# EasyEDA Pro project NeuralAccelerator_EasyEDA.epro, board PCB1
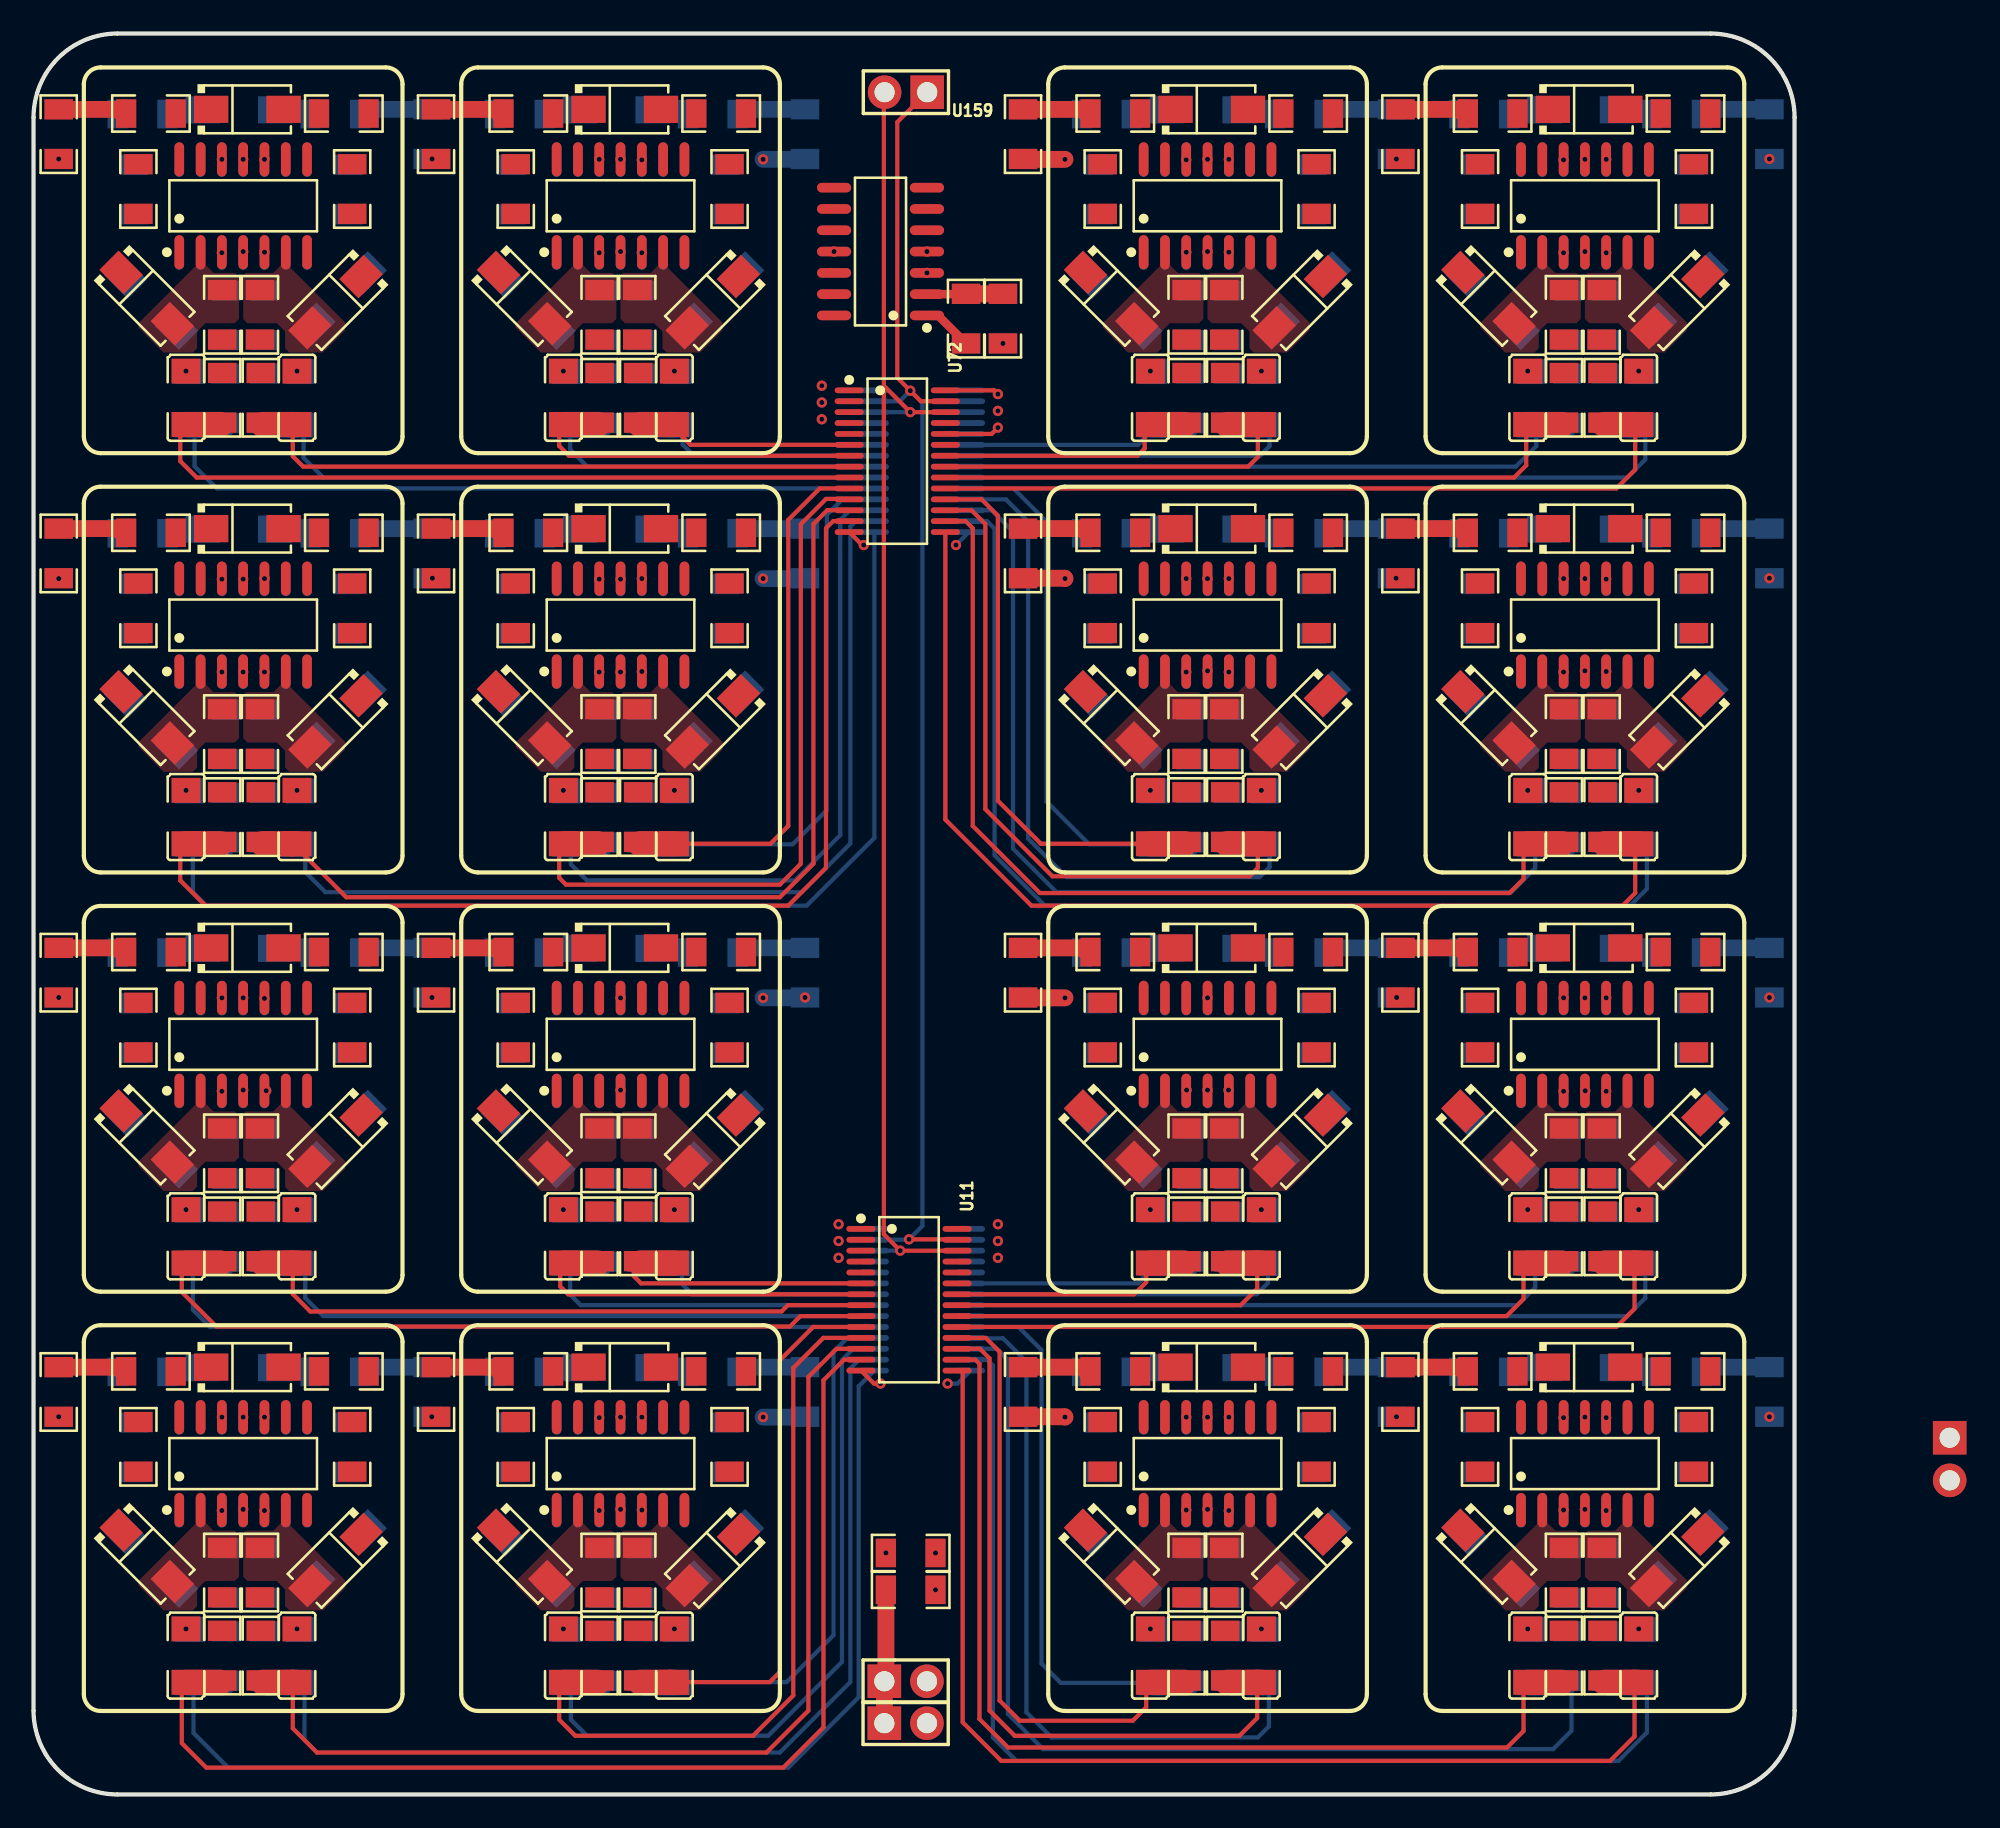
[diagram p6: board, top side]
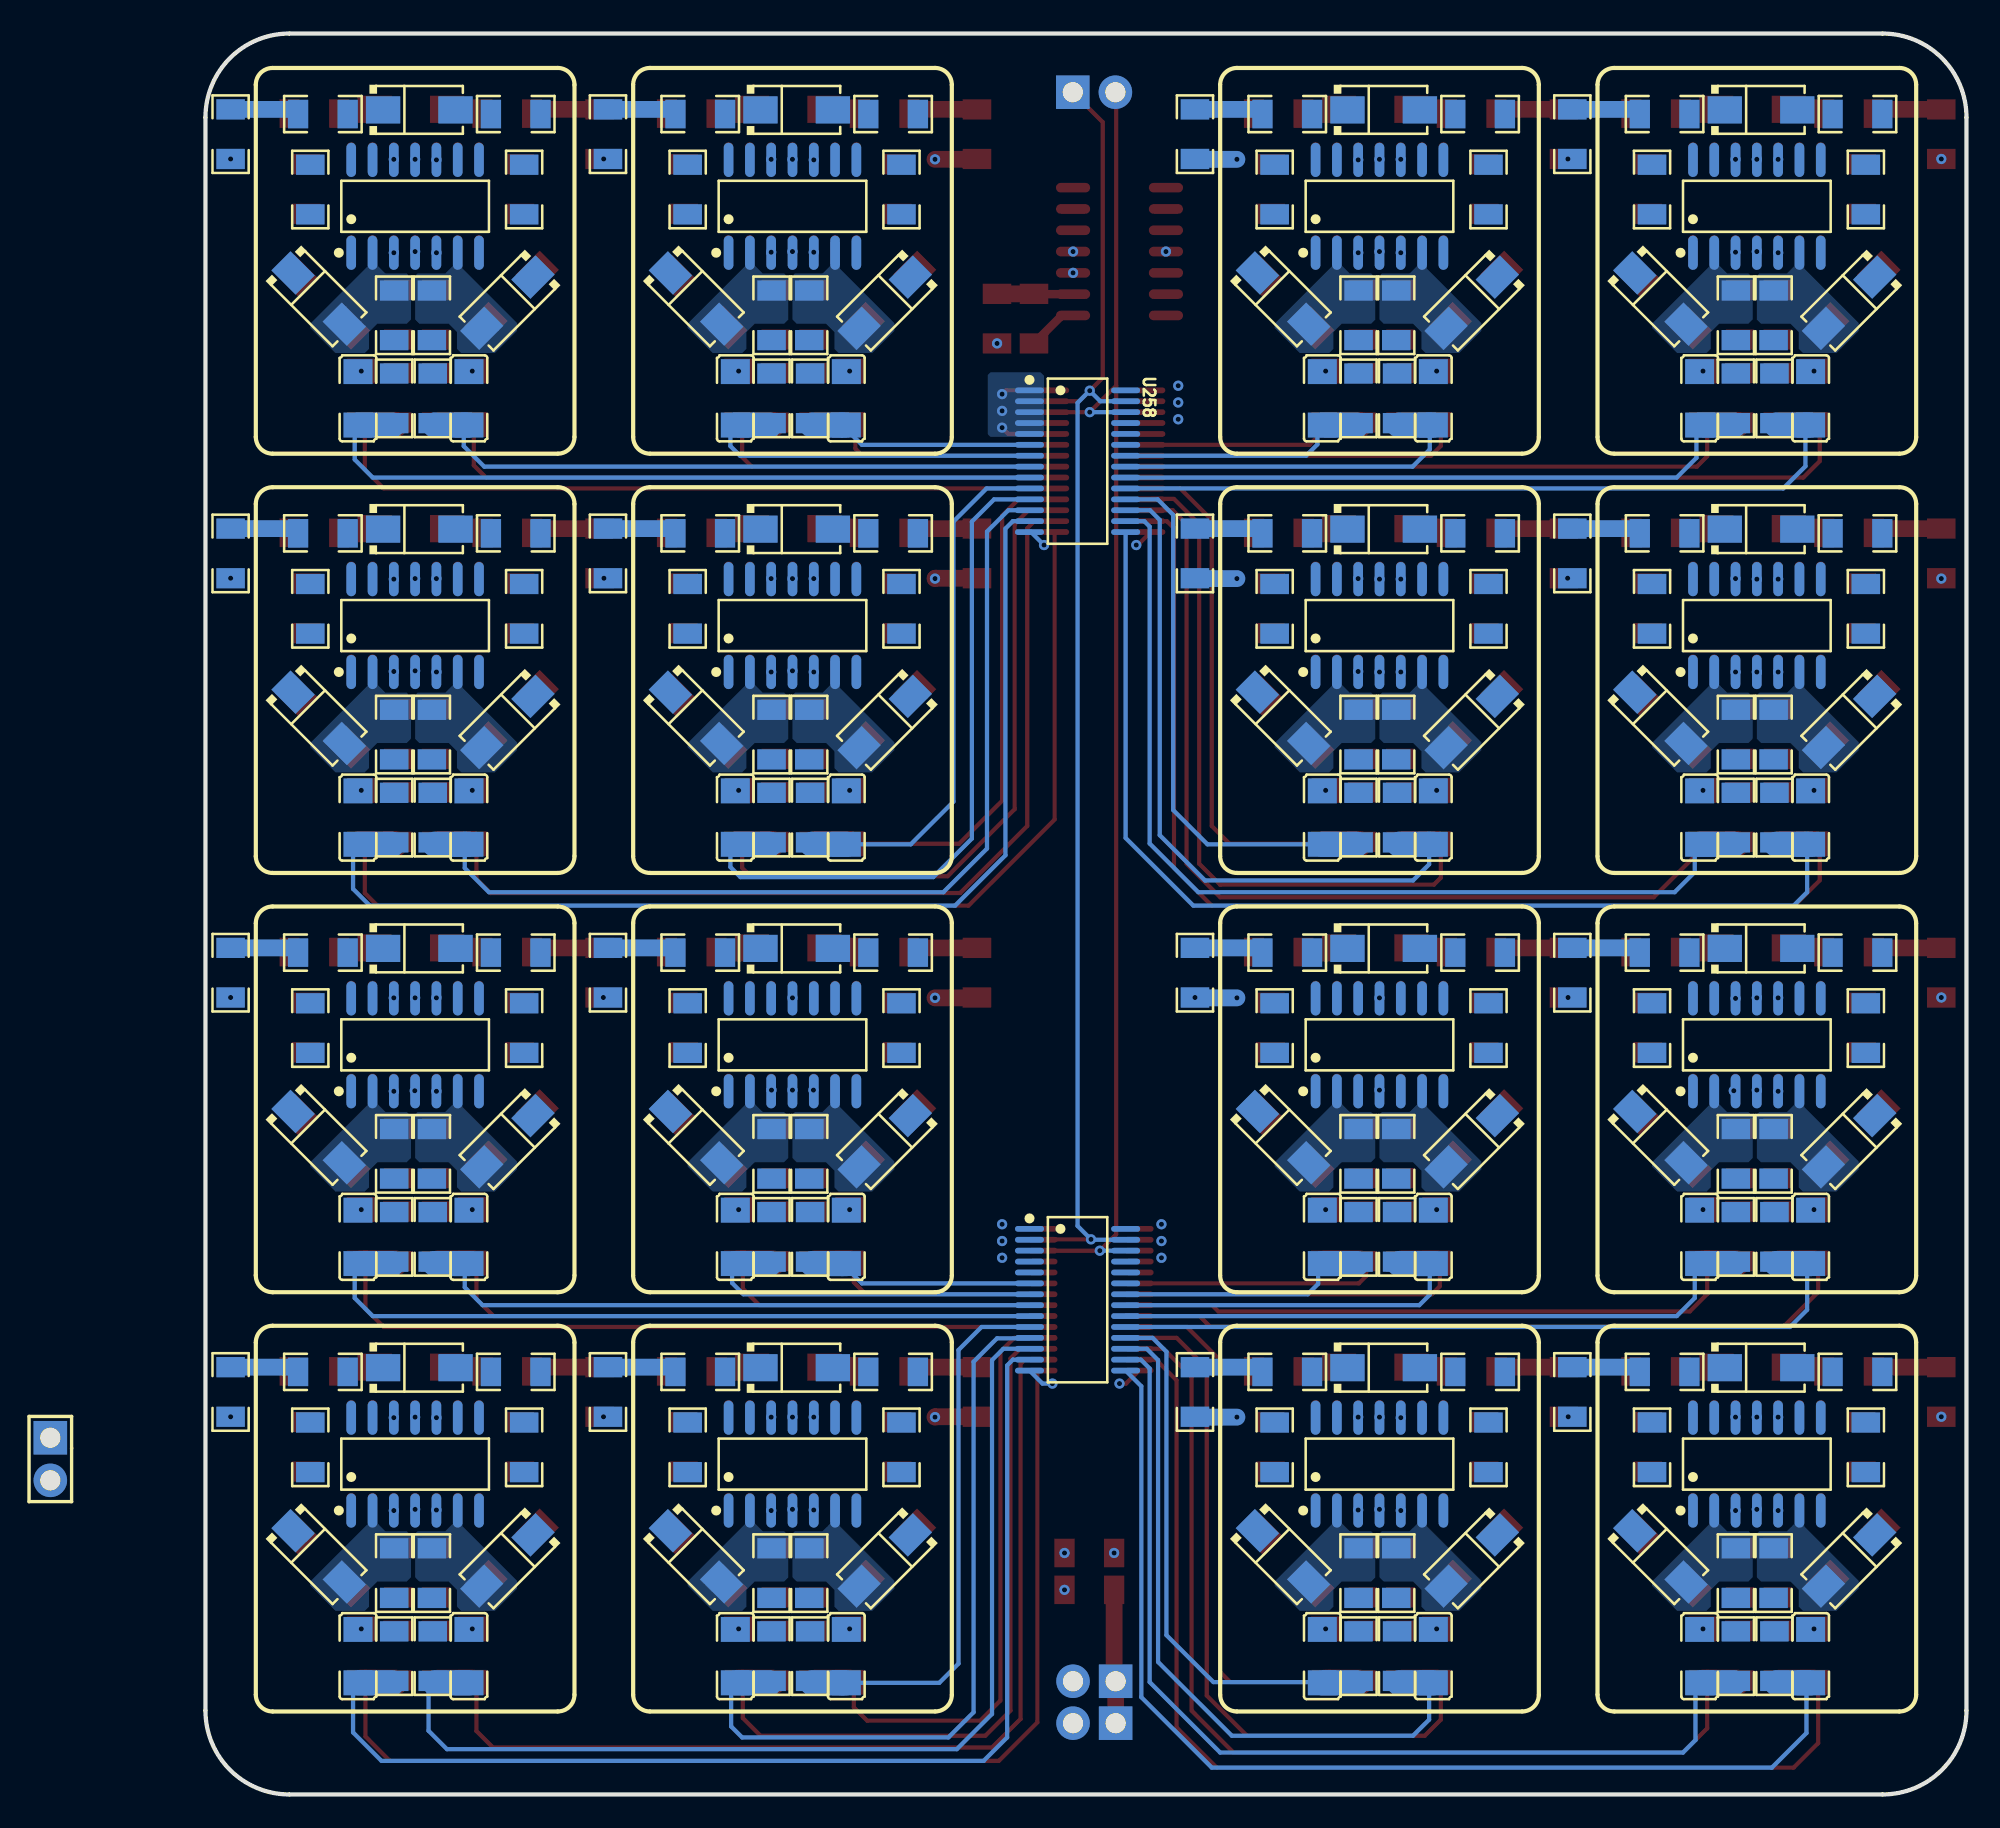
[diagram p7: board, bottom side, seen from below]

Outline 105 x 105 mm; copper layers: Top Layer, Inner1, Inner2, Inner3, Inner4, Bottom Layer. Coordinates in mm from the lower left corner of the outline.
Outline path: 0,100 0,5 arc(1.46,1.46) 5,0 100,0 arc(103.54,1.46) 105,5 105,100 arc(103.54,103.54) 100,105 5,105 arc(1.46,103.54) 0,100
Stack: Top Layer 0.035mm 外层铜厚1oz / Dielectric1 0.0994mm 3313 RC57% 4.2mil / Inner1 0.0152mm 内层铜厚 / Dielectric2 0.55mm 0.55mm H/H不含铜 / Inner2 0.0152mm 内层铜厚 / Dielectric3 0.1088mm 2116 RC54% 4.9mil / Inner3 0.0152mm 内层铜厚 / Dielectric4 0.55mm 0.55mm H/H不含铜 / Inner4 0.0152mm 内层铜厚 / Dielectric5 0.0994mm 3313 RC57% 4.2mil / Bottom Layer 0.035mm 外层铜厚1oz

## Design rules (mm)
template: Custom Config
spacing copperThickness1oz (default): track to track 0.102, other pairs 0.152 to 0.3
spacing copperThickness2oz: track to track 0.203, other pairs 0.152 to 0.3
track width copperThickness1oz (default): min 0.127, default 0.254, max 10
track width copperThickness2oz: min 0.203, default 0.254, max 2.54
differential pair differentialPair (default): width min 0.127, default 0.254, max 2.54; gap min 0.152, default 0.152
via viaSize (default): diameter min 0.5, default 0.61, max 10; hole min 0.3, default 0.305, max 6.3

## Placement (name value [footprint] x y rotation side)
R1  50K±0.1%  [R1206]  52.3 14.4 0 top
R2  50K±0.1%  [R1206]  52.3 12.2 180 top
R3  6.2Ω  [R1206]  11.25 8.28 90 top
R4  6.2Ω  [R1206]  13.55 8.28 90 top
R5  50K±0.1%  [R1206]  33.75 13.23 270 top
R6  50K±0.1%  [R1206]  36 13.23 270 top
R7  50K±0.1%  [R1206]  11.25 13.23 270 top
R8  50K±0.1%  [R1206]  13.5 13.23 270 top
R9  50K±0.1%  [R1206]  6.25 20.73 270 top
R10  50K±0.1%  [R1206]  19 20.73 270 top
R11  50K±0.1%  [R1206]  18.5 25.23 0 top
R12  50K±0.1%  [R1206]  7 25.23 0 top
R13  50K±0.1%  [R1206]  28.75 20.73 270 top
R14  50K±0.1%  [R1206]  41.5 20.73 270 top
R15  50K±0.1%  [R1206]  41 25.23 0 top
R16  50K±0.1%  [R1206]  29.5 25.23 0 top
R17  6.2Ω  [R1206]  33.75 8.28 90 top
R18  6.2Ω  [R1206]  36.05 8.28 90 top
R172  50K±0.1%  [R1206]  1.5 24 90 top
R175  50K±0.1%  [R1206]  24 24 90 top
R192  50K±0.1%  [R1206]  59 24 90 top
R193  50K±0.1%  [R1206]  81.5 24 90 top
R226  50K±0.1%  [R1206]  1.5 49 90 top
R227  50K±0.1%  [R1206]  24 49 90 top
R228  50K±0.1%  [R1206]  59 49 90 top
R229  50K±0.1%  [R1206]  81.5 49 90 top
R294  50K±0.1%  [R1206]  1.5 74 90 top
R295  50K±0.1%  [R1206]  24 74 90 top
R296  50K±0.1%  [R1206]  59 74 90 top
R297  50K±0.1%  [R1206]  81.5 74 90 top
R298  50K±0.1%  [R1206]  1.5 99 90 top
R299  50K±0.1%  [R1206]  24 99 90 top
R300  50K±0.1%  [R1206]  59 99 90 top
R301  50K±0.1%  [R1206]  81.5 99 90 top
R302  50K±0.1%  [R1206]  68.75 13.23 270 top
R303  50K±0.1%  [R1206]  91.25 13.23 270 top
R304  50K±0.1%  [R1206]  71 13.23 270 top
R305  50K±0.1%  [R1206]  93.5 13.23 270 top
R306  50K±0.1%  [R1206]  63.75 20.73 270 top
R307  50K±0.1%  [R1206]  86.25 20.73 270 top
R308  50K±0.1%  [R1206]  76.5 20.73 270 top
R309  50K±0.1%  [R1206]  99 20.73 270 top
R310  50K±0.1%  [R1206]  76 25.23 0 top
R311  50K±0.1%  [R1206]  98.5 25.23 0 top
R312  50K±0.1%  [R1206]  64.5 25.23 0 top
R313  50K±0.1%  [R1206]  87 25.23 0 top
R314  6.2Ω  [R1206]  68.75 8.28 90 top
R315  6.2Ω  [R1206]  91.25 8.28 90 top
R316  6.2Ω  [R1206]  71.05 8.28 90 top
R317  6.2Ω  [R1206]  93.55 8.28 90 top
R318  50K±0.1%  [R1206]  11.25 38.23 270 top
R319  50K±0.1%  [R1206]  33.75 38.23 270 top
R320  50K±0.1%  [R1206]  68.75 38.23 270 top
R321  50K±0.1%  [R1206]  91.25 38.23 270 top
R322  50K±0.1%  [R1206]  13.5 38.23 270 top
R323  50K±0.1%  [R1206]  36 38.23 270 top
R324  50K±0.1%  [R1206]  71 38.23 270 top
R325  50K±0.1%  [R1206]  93.5 38.23 270 top
R326  50K±0.1%  [R1206]  6.25 45.73 270 top
R327  50K±0.1%  [R1206]  28.75 45.73 270 top
R328  50K±0.1%  [R1206]  63.75 45.73 270 top
R329  50K±0.1%  [R1206]  86.25 45.73 270 top
R330  50K±0.1%  [R1206]  19 45.73 270 top
R331  50K±0.1%  [R1206]  41.5 45.73 270 top
R332  50K±0.1%  [R1206]  76.5 45.73 270 top
R333  50K±0.1%  [R1206]  99 45.73 270 top
R334  50K±0.1%  [R1206]  18.5 50.23 0 top
R335  50K±0.1%  [R1206]  41 50.23 0 top
R336  50K±0.1%  [R1206]  76 50.23 0 top
R337  50K±0.1%  [R1206]  98.5 50.23 0 top
R338  50K±0.1%  [R1206]  7 50.23 0 top
R339  50K±0.1%  [R1206]  29.5 50.23 0 top
R340  50K±0.1%  [R1206]  64.5 50.23 0 top
R341  50K±0.1%  [R1206]  87 50.23 0 top
R342  6.2Ω  [R1206]  11.25 33.28 90 top
R343  6.2Ω  [R1206]  33.75 33.28 90 top
R344  6.2Ω  [R1206]  68.75 33.28 90 top
R345  6.2Ω  [R1206]  91.25 33.28 90 top
R346  6.2Ω  [R1206]  13.55 33.28 90 top
R347  6.2Ω  [R1206]  36.05 33.28 90 top
R348  6.2Ω  [R1206]  71.05 33.28 90 top
R349  6.2Ω  [R1206]  93.55 33.28 90 top
R350  50K±0.1%  [R1206]  11.25 88.23 270 top
R351  50K±0.1%  [R1206]  33.75 88.23 270 top
R352  50K±0.1%  [R1206]  68.75 88.23 270 top
R353  50K±0.1%  [R1206]  91.25 88.23 270 top
R354  50K±0.1%  [R1206]  91.25 63.23 270 top
R355  50K±0.1%  [R1206]  68.75 63.23 270 top
R356  50K±0.1%  [R1206]  33.75 63.23 270 top
R357  50K±0.1%  [R1206]  11.25 63.23 270 top
R358  50K±0.1%  [R1206]  13.5 88.23 270 top
R359  50K±0.1%  [R1206]  36 88.23 270 top
R360  50K±0.1%  [R1206]  71 88.23 270 top
R361  50K±0.1%  [R1206]  93.5 88.23 270 top
R362  50K±0.1%  [R1206]  93.5 63.23 270 top
R363  50K±0.1%  [R1206]  71 63.23 270 top
R364  50K±0.1%  [R1206]  36 63.23 270 top
R365  50K±0.1%  [R1206]  13.5 63.23 270 top
R366  50K±0.1%  [R1206]  6.25 95.73 270 top
R367  50K±0.1%  [R1206]  28.75 95.73 270 top
R368  50K±0.1%  [R1206]  63.75 95.73 270 top
R369  50K±0.1%  [R1206]  86.25 95.73 270 top
R370  50K±0.1%  [R1206]  86.25 70.73 270 top
R371  50K±0.1%  [R1206]  63.75 70.73 270 top
R372  50K±0.1%  [R1206]  28.75 70.73 270 top
R373  50K±0.1%  [R1206]  6.25 70.73 270 top
R374  50K±0.1%  [R1206]  19 95.73 270 top
R375  50K±0.1%  [R1206]  41.5 95.73 270 top
R376  50K±0.1%  [R1206]  76.5 95.73 270 top
R377  50K±0.1%  [R1206]  99 95.73 270 top
R378  50K±0.1%  [R1206]  99 70.73 270 top
R379  50K±0.1%  [R1206]  76.5 70.73 270 top
R380  50K±0.1%  [R1206]  41.5 70.73 270 top
R381  50K±0.1%  [R1206]  19 70.73 270 top
R382  50K±0.1%  [R1206]  18.5 100.23 0 top
R383  50K±0.1%  [R1206]  41 100.23 0 top
R384  50K±0.1%  [R1206]  76 100.23 0 top
R385  50K±0.1%  [R1206]  98.5 100.23 0 top
R386  50K±0.1%  [R1206]  98.5 75.23 0 top
R387  50K±0.1%  [R1206]  76 75.23 0 top
R388  50K±0.1%  [R1206]  41 75.23 0 top
R389  50K±0.1%  [R1206]  18.5 75.23 0 top
R390  50K±0.1%  [R1206]  7 100.23 0 top
R391  50K±0.1%  [R1206]  29.5 100.23 0 top
R392  50K±0.1%  [R1206]  64.5 100.23 0 top
R393  50K±0.1%  [R1206]  87 100.23 0 top
R394  50K±0.1%  [R1206]  87 75.23 0 top
R395  50K±0.1%  [R1206]  64.5 75.23 0 top
R396  50K±0.1%  [R1206]  29.5 75.23 0 top
R397  50K±0.1%  [R1206]  7 75.23 0 top
R398  6.2Ω  [R1206]  11.25 83.28 90 top
R399  6.2Ω  [R1206]  33.75 83.28 90 top
R400  6.2Ω  [R1206]  68.75 83.28 90 top
R401  6.2Ω  [R1206]  91.25 83.28 90 top
R402  6.2Ω  [R1206]  91.25 58.28 90 top
R403  6.2Ω  [R1206]  68.75 58.28 90 top
R404  6.2Ω  [R1206]  33.75 58.28 90 top
R405  6.2Ω  [R1206]  11.25 58.28 90 top
R406  6.2Ω  [R1206]  13.55 83.28 90 top
R407  6.2Ω  [R1206]  36.05 83.28 90 top
R408  6.2Ω  [R1206]  71.05 83.28 90 top
R409  6.2Ω  [R1206]  93.55 83.28 90 top
R410  6.2Ω  [R1206]  93.55 58.28 90 top
R411  6.2Ω  [R1206]  71.05 58.28 90 top
R412  6.2Ω  [R1206]  36.05 58.28 90 top
R413  6.2Ω  [R1206]  13.55 58.28 90 top
R414  50K±0.1%  [R1206]  93.75 13.2 270 bottom
R415  50K±0.1%  [R1206]  71.25 13.2 270 bottom
R416  50K±0.1%  [R1206]  36.25 13.2 270 bottom
R417  50K±0.1%  [R1206]  13.75 13.2 270 bottom
R418  50K±0.1%  [R1206]  93.75 38.2 270 bottom
R419  50K±0.1%  [R1206]  71.25 38.2 270 bottom
R420  50K±0.1%  [R1206]  36.25 38.2 270 bottom
R421  50K±0.1%  [R1206]  13.75 38.2 270 bottom
R422  50K±0.1%  [R1206]  93.75 63.2 270 bottom
R423  50K±0.1%  [R1206]  71.25 63.2 270 bottom
R424  50K±0.1%  [R1206]  36.25 63.2 270 bottom
R425  50K±0.1%  [R1206]  13.75 63.2 270 bottom
R426  50K±0.1%  [R1206]  93.75 88.2 270 bottom
R427  50K±0.1%  [R1206]  71.25 88.2 270 bottom
R428  50K±0.1%  [R1206]  36.25 88.2 270 bottom
R429  50K±0.1%  [R1206]  13.75 88.2 270 bottom
R430  50K±0.1%  [R1206]  91.5 13.2 270 bottom
R431  50K±0.1%  [R1206]  69 13.2 270 bottom
R432  50K±0.1%  [R1206]  34 13.2 270 bottom
R433  50K±0.1%  [R1206]  11.5 13.2 270 bottom
R434  50K±0.1%  [R1206]  91.5 38.2 270 bottom
R435  50K±0.1%  [R1206]  69 38.2 270 bottom
R436  50K±0.1%  [R1206]  34 38.2 270 bottom
R437  50K±0.1%  [R1206]  11.5 38.2 270 bottom
R438  50K±0.1%  [R1206]  91.5 63.2 270 bottom
R439  50K±0.1%  [R1206]  69 63.2 270 bottom
R440  50K±0.1%  [R1206]  34 63.2 270 bottom
R441  50K±0.1%  [R1206]  11.5 63.2 270 bottom
R442  50K±0.1%  [R1206]  91.5 88.2 270 bottom
R443  50K±0.1%  [R1206]  69 88.2 270 bottom
R444  50K±0.1%  [R1206]  34 88.2 270 bottom
R445  50K±0.1%  [R1206]  11.5 88.2 270 bottom
R446  50K±0.1%  [R1206]  98.75 20.7 270 bottom
R447  50K±0.1%  [R1206]  76.25 20.7 270 bottom
R448  50K±0.1%  [R1206]  41.25 20.7 270 bottom
R449  50K±0.1%  [R1206]  18.75 20.7 270 bottom
R450  50K±0.1%  [R1206]  98.75 45.7 270 bottom
R451  50K±0.1%  [R1206]  76.25 45.7 270 bottom
R452  50K±0.1%  [R1206]  41.25 45.7 270 bottom
R453  50K±0.1%  [R1206]  18.75 45.7 270 bottom
R454  50K±0.1%  [R1206]  98.75 70.7 270 bottom
R455  50K±0.1%  [R1206]  76.25 70.7 270 bottom
R456  50K±0.1%  [R1206]  41.25 70.7 270 bottom
R457  50K±0.1%  [R1206]  18.75 70.7 270 bottom
R458  50K±0.1%  [R1206]  98.75 95.7 270 bottom
R459  50K±0.1%  [R1206]  76.25 95.7 270 bottom
R460  50K±0.1%  [R1206]  41.25 95.7 270 bottom
R461  50K±0.1%  [R1206]  18.75 95.7 270 bottom
R462  50K±0.1%  [R1206]  86 20.7 270 bottom
R463  50K±0.1%  [R1206]  63.5 20.7 270 bottom
R464  50K±0.1%  [R1206]  28.5 20.7 270 bottom
R465  50K±0.1%  [R1206]  6 20.7 270 bottom
R466  50K±0.1%  [R1206]  86 45.7 270 bottom
R467  50K±0.1%  [R1206]  63.5 45.7 270 bottom
R468  50K±0.1%  [R1206]  28.5 45.7 270 bottom
R469  50K±0.1%  [R1206]  6 45.7 270 bottom
R470  50K±0.1%  [R1206]  86 70.7 270 bottom
R471  50K±0.1%  [R1206]  63.5 70.7 270 bottom
R472  50K±0.1%  [R1206]  28.5 70.7 270 bottom
R473  50K±0.1%  [R1206]  6 70.7 270 bottom
R474  50K±0.1%  [R1206]  86 95.7 270 bottom
R475  50K±0.1%  [R1206]  63.5 95.7 270 bottom
R476  50K±0.1%  [R1206]  28.5 95.7 270 bottom
R477  50K±0.1%  [R1206]  6 95.7 270 bottom
R478  50K±0.1%  [R1206]  86.5 25.2 180 bottom
R479  50K±0.1%  [R1206]  64 25.2 180 bottom
R480  50K±0.1%  [R1206]  29 25.2 180 bottom
R481  50K±0.1%  [R1206]  6.5 25.2 180 bottom
R482  50K±0.1%  [R1206]  86.5 50.2 180 bottom
R483  50K±0.1%  [R1206]  64 50.2 180 bottom
R484  50K±0.1%  [R1206]  29 50.2 180 bottom
R485  50K±0.1%  [R1206]  6.5 50.2 180 bottom
R486  50K±0.1%  [R1206]  86.5 75.2 180 bottom
R487  50K±0.1%  [R1206]  64 75.2 180 bottom
R488  50K±0.1%  [R1206]  29 75.2 180 bottom
R489  50K±0.1%  [R1206]  6.5 75.2 180 bottom
R490  50K±0.1%  [R1206]  86.5 100.2 180 bottom
R491  50K±0.1%  [R1206]  64 100.2 180 bottom
R492  50K±0.1%  [R1206]  29 100.2 180 bottom
R493  50K±0.1%  [R1206]  6.5 100.2 180 bottom
R494  50K±0.1%  [R1206]  98 25.2 180 bottom
R495  50K±0.1%  [R1206]  75.5 25.2 180 bottom
R496  50K±0.1%  [R1206]  40.5 25.2 180 bottom
R497  50K±0.1%  [R1206]  18 25.2 180 bottom
R498  50K±0.1%  [R1206]  98 50.2 180 bottom
R499  50K±0.1%  [R1206]  75.5 50.2 180 bottom
R500  50K±0.1%  [R1206]  40.5 50.2 180 bottom
R501  50K±0.1%  [R1206]  18 50.2 180 bottom
R502  50K±0.1%  [R1206]  98 75.2 180 bottom
R503  50K±0.1%  [R1206]  75.5 75.2 180 bottom
R504  50K±0.1%  [R1206]  40.5 75.2 180 bottom
R505  50K±0.1%  [R1206]  18 75.2 180 bottom
R506  50K±0.1%  [R1206]  98 100.2 180 bottom
R507  50K±0.1%  [R1206]  75.5 100.2 180 bottom
R508  50K±0.1%  [R1206]  40.5 100.2 180 bottom
R509  50K±0.1%  [R1206]  18 100.2 180 bottom
R510  6.2Ω  [R1206]  93.75 8.25 90 bottom
R511  6.2Ω  [R1206]  71.25 8.25 90 bottom
R512  6.2Ω  [R1206]  36.25 8.25 90 bottom
R513  6.2Ω  [R1206]  13.75 8.25 90 bottom
R514  6.2Ω  [R1206]  93.75 33.25 90 bottom
R515  6.2Ω  [R1206]  71.25 33.25 90 bottom
R516  6.2Ω  [R1206]  36.25 33.25 90 bottom
R517  6.2Ω  [R1206]  13.75 33.25 90 bottom
R518  6.2Ω  [R1206]  93.75 58.25 90 bottom
R519  6.2Ω  [R1206]  71.25 58.25 90 bottom
R520  6.2Ω  [R1206]  36.25 58.25 90 bottom
R521  6.2Ω  [R1206]  13.75 58.25 90 bottom
R522  6.2Ω  [R1206]  93.75 83.25 90 bottom
R523  6.2Ω  [R1206]  71.25 83.25 90 bottom
R524  6.2Ω  [R1206]  36.25 83.25 90 bottom
R525  6.2Ω  [R1206]  13.75 83.25 90 bottom
R526  6.2Ω  [R1206]  91.45 8.25 90 bottom
R527  6.2Ω  [R1206]  68.95 8.25 90 bottom
R528  6.2Ω  [R1206]  33.95 8.25 90 bottom
R529  6.2Ω  [R1206]  11.45 8.25 90 bottom
R530  6.2Ω  [R1206]  91.45 33.25 90 bottom
R531  6.2Ω  [R1206]  68.95 33.25 90 bottom
R532  6.2Ω  [R1206]  33.95 33.25 90 bottom
R533  6.2Ω  [R1206]  11.45 33.25 90 bottom
R534  6.2Ω  [R1206]  91.45 58.25 90 bottom
R535  6.2Ω  [R1206]  68.95 58.25 90 bottom
R536  6.2Ω  [R1206]  33.95 58.25 90 bottom
R537  6.2Ω  [R1206]  11.45 58.25 90 bottom
R538  6.2Ω  [R1206]  91.45 83.25 90 bottom
R539  6.2Ω  [R1206]  68.95 83.25 90 bottom
R540  6.2Ω  [R1206]  33.95 83.25 90 bottom
R541  6.2Ω  [R1206]  11.45 83.25 90 bottom
R542  50K±0.1%  [R1206]  103.5 24 90 bottom
R543  50K±0.1%  [R1206]  81 24 90 bottom
R544  50K±0.1%  [R1206]  46 24 90 bottom
R545  50K±0.1%  [R1206]  23.5 24 90 bottom
R546  50K±0.1%  [R1206]  103.5 49 90 bottom
R547  50K±0.1%  [R1206]  81 49 90 bottom
R548  50K±0.1%  [R1206]  46 49 90 bottom
R549  50K±0.1%  [R1206]  23.5 49 90 bottom
R550  50K±0.1%  [R1206]  103.5 74 90 bottom
R551  50K±0.1%  [R1206]  81 74 90 bottom
R552  50K±0.1%  [R1206]  46 74 90 bottom
R553  50K±0.1%  [R1206]  23.5 74 90 bottom
R554  50K±0.1%  [R1206]  103.5 99 90 bottom
R555  50K±0.1%  [R1206]  81 99 90 bottom
R556  50K±0.1%  [R1206]  46 99 90 bottom
R557  50K±0.1%  [R1206]  23.5 99 90 bottom
Ra  50K±0.1%  [R1206]  55.6 88 270 top
Rb  50K±0.1%  [R1206]  57.8 88 90 top
U1  12pF  [C1206]  9.09 8.28 270 top
U2  12pF  [C1206]  15.71 8.28 270 top
U3  1N4007 M7  [SMA_L4.2-W2.7-LS5.3-RD]  29.25 14.23 315 top
U4  1N4007 M7  [SMA_L4.2-W2.7-LS5.3-RD]  40.5 13.98 225 top
U5  1N4007 M7  [SMA_L4.2-W2.7-LS5.3-RD]  35.25 25.48 0 top
U6  TL084CDR  [SOIC-14_L8.7-W3.9-P1.27-LS6.0-BL]  12.5 19.73 0 top
U7  1N4007 M7  [SMA_L4.2-W2.7-LS5.3-RD]  6.75 14.23 315 top
U8  1N4007 M7  [SMA_L4.2-W2.7-LS5.3-RD]  18 13.98 225 top
U9  1N4007 M7  [SMA_L4.2-W2.7-LS5.3-RD]  12.75 25.48 0 top
U10  TL084CDRG4  [SOIC-14_L8.7-W3.9-P1.27-LS6.0-BL]  50.5 92 90 top
U11  PCA9685PW,112  [TSSOP-28_L9.7-W4.4-P0.65-LS6.4-BL]  52.2 29.5 270 top
U12  12pF  [C1206]  31.59 8.28 270 top
U13  12pF  [C1206]  38.21 8.28 270 top
U14  TL084CDR  [SOIC-14_L8.7-W3.9-P1.27-LS6.0-BL]  35 19.73 0 top
U72  PCA9685PW,112  [TSSOP-28_L9.7-W4.4-P0.65-LS6.4-BL]  51.5 79.5 270 top
U73  1N4007 M7  [SMA_L4.2-W2.7-LS5.3-RD]  64.25 14.23 315 top
U74  1N4007 M7  [SMA_L4.2-W2.7-LS5.3-RD]  86.75 14.23 315 top
U75  1N4007 M7  [SMA_L4.2-W2.7-LS5.3-RD]  75.5 13.98 225 top
U76  1N4007 M7  [SMA_L4.2-W2.7-LS5.3-RD]  98 13.98 225 top
U77  1N4007 M7  [SMA_L4.2-W2.7-LS5.3-RD]  70.25 25.48 0 top
U78  1N4007 M7  [SMA_L4.2-W2.7-LS5.3-RD]  92.75 25.48 0 top
U79  12pF  [C1206]  66.59 8.28 270 top
U80  12pF  [C1206]  89.09 8.28 270 top
U81  12pF  [C1206]  73.21 8.28 270 top
U82  12pF  [C1206]  95.71 8.28 270 top
U83  TL084CDR  [SOIC-14_L8.7-W3.9-P1.27-LS6.0-BL]  70 19.73 0 top
U84  TL084CDR  [SOIC-14_L8.7-W3.9-P1.27-LS6.0-BL]  92.5 19.73 0 top
U85  1N4007 M7  [SMA_L4.2-W2.7-LS5.3-RD]  6.75 39.23 315 top
U86  1N4007 M7  [SMA_L4.2-W2.7-LS5.3-RD]  29.25 39.23 315 top
U87  1N4007 M7  [SMA_L4.2-W2.7-LS5.3-RD]  64.25 39.23 315 top
U88  1N4007 M7  [SMA_L4.2-W2.7-LS5.3-RD]  86.75 39.23 315 top
U89  1N4007 M7  [SMA_L4.2-W2.7-LS5.3-RD]  18 38.98 225 top
U90  1N4007 M7  [SMA_L4.2-W2.7-LS5.3-RD]  40.5 38.98 225 top
U91  1N4007 M7  [SMA_L4.2-W2.7-LS5.3-RD]  75.5 38.98 225 top
U92  1N4007 M7  [SMA_L4.2-W2.7-LS5.3-RD]  98 38.98 225 top
U93  1N4007 M7  [SMA_L4.2-W2.7-LS5.3-RD]  12.75 50.48 0 top
U94  1N4007 M7  [SMA_L4.2-W2.7-LS5.3-RD]  35.25 50.48 0 top
U95  1N4007 M7  [SMA_L4.2-W2.7-LS5.3-RD]  70.25 50.48 0 top
U96  1N4007 M7  [SMA_L4.2-W2.7-LS5.3-RD]  92.75 50.48 0 top
U97  12pF  [C1206]  9.09 33.28 270 top
U98  12pF  [C1206]  31.59 33.28 270 top
U99  12pF  [C1206]  66.59 33.28 270 top
U100  12pF  [C1206]  89.09 33.28 270 top
U101  12pF  [C1206]  15.71 33.28 270 top
U102  12pF  [C1206]  38.21 33.28 270 top
U103  12pF  [C1206]  73.21 33.28 270 top
U104  12pF  [C1206]  95.71 33.28 270 top
U105  TL084CDR  [SOIC-14_L8.7-W3.9-P1.27-LS6.0-BL]  12.5 44.73 0 top
U106  TL084CDR  [SOIC-14_L8.7-W3.9-P1.27-LS6.0-BL]  35 44.73 0 top
U107  TL084CDR  [SOIC-14_L8.7-W3.9-P1.27-LS6.0-BL]  70 44.73 0 top
U108  TL084CDR  [SOIC-14_L8.7-W3.9-P1.27-LS6.0-BL]  92.5 44.73 0 top
U109  1N4007 M7  [SMA_L4.2-W2.7-LS5.3-RD]  6.75 89.23 315 top
U110  1N4007 M7  [SMA_L4.2-W2.7-LS5.3-RD]  29.25 89.23 315 top
U111  1N4007 M7  [SMA_L4.2-W2.7-LS5.3-RD]  64.25 89.23 315 top
U112  1N4007 M7  [SMA_L4.2-W2.7-LS5.3-RD]  86.75 89.23 315 top
U113  1N4007 M7  [SMA_L4.2-W2.7-LS5.3-RD]  86.75 64.23 315 top
U114  1N4007 M7  [SMA_L4.2-W2.7-LS5.3-RD]  64.25 64.23 315 top
U115  1N4007 M7  [SMA_L4.2-W2.7-LS5.3-RD]  29.25 64.23 315 top
U116  1N4007 M7  [SMA_L4.2-W2.7-LS5.3-RD]  6.75 64.23 315 top
U117  1N4007 M7  [SMA_L4.2-W2.7-LS5.3-RD]  18 88.98 225 top
U118  1N4007 M7  [SMA_L4.2-W2.7-LS5.3-RD]  40.5 88.98 225 top
U119  1N4007 M7  [SMA_L4.2-W2.7-LS5.3-RD]  75.5 88.98 225 top
U120  1N4007 M7  [SMA_L4.2-W2.7-LS5.3-RD]  98 88.98 225 top
U121  1N4007 M7  [SMA_L4.2-W2.7-LS5.3-RD]  98 63.98 225 top
U122  1N4007 M7  [SMA_L4.2-W2.7-LS5.3-RD]  75.5 63.98 225 top
U123  1N4007 M7  [SMA_L4.2-W2.7-LS5.3-RD]  40.5 63.98 225 top
U124  1N4007 M7  [SMA_L4.2-W2.7-LS5.3-RD]  18 63.98 225 top
U125  1N4007 M7  [SMA_L4.2-W2.7-LS5.3-RD]  12.75 100.48 0 top
U126  1N4007 M7  [SMA_L4.2-W2.7-LS5.3-RD]  35.25 100.48 0 top
U127  1N4007 M7  [SMA_L4.2-W2.7-LS5.3-RD]  70.25 100.48 0 top
U128  1N4007 M7  [SMA_L4.2-W2.7-LS5.3-RD]  92.75 100.48 0 top
U129  1N4007 M7  [SMA_L4.2-W2.7-LS5.3-RD]  92.75 75.48 0 top
U130  1N4007 M7  [SMA_L4.2-W2.7-LS5.3-RD]  70.25 75.48 0 top
U131  1N4007 M7  [SMA_L4.2-W2.7-LS5.3-RD]  35.25 75.48 0 top
U132  1N4007 M7  [SMA_L4.2-W2.7-LS5.3-RD]  12.75 75.48 0 top
U133  12pF  [C1206]  9.09 83.28 270 top
U134  12pF  [C1206]  31.59 83.28 270 top
U135  12pF  [C1206]  66.59 83.28 270 top
U136  12pF  [C1206]  89.09 83.28 270 top
U137  12pF  [C1206]  89.09 58.28 270 top
U138  12pF  [C1206]  66.59 58.28 270 top
U139  12pF  [C1206]  31.59 58.28 270 top
U140  12pF  [C1206]  9.09 58.28 270 top
U141  12pF  [C1206]  15.71 83.28 270 top
U142  12pF  [C1206]  38.21 83.28 270 top
U143  12pF  [C1206]  73.21 83.28 270 top
U144  12pF  [C1206]  95.71 83.28 270 top
U145  12pF  [C1206]  95.71 58.28 270 top
U146  12pF  [C1206]  73.21 58.28 270 top
U147  12pF  [C1206]  38.21 58.28 270 top
U148  12pF  [C1206]  15.71 58.28 270 top
U149  TL084CDR  [SOIC-14_L8.7-W3.9-P1.27-LS6.0-BL]  12.5 94.73 0 top
U150  TL084CDR  [SOIC-14_L8.7-W3.9-P1.27-LS6.0-BL]  35 94.73 0 top
U151  TL084CDR  [SOIC-14_L8.7-W3.9-P1.27-LS6.0-BL]  70 94.73 0 top
U152  TL084CDR  [SOIC-14_L8.7-W3.9-P1.27-LS6.0-BL]  92.5 94.73 0 top
U153  TL084CDR  [SOIC-14_L8.7-W3.9-P1.27-LS6.0-BL]  92.5 69.73 0 top
U154  TL084CDR  [SOIC-14_L8.7-W3.9-P1.27-LS6.0-BL]  70 69.73 0 top
U155  TL084CDR  [SOIC-14_L8.7-W3.9-P1.27-LS6.0-BL]  35 69.73 0 top
U156  TL084CDR  [SOIC-14_L8.7-W3.9-P1.27-LS6.0-BL]  12.5 69.73 0 top
U157  2.54-1*2  [HDR-TH_2P-P2.54-V-M]  52 6.75 0 top
U158  2.54-1*2  [HDR-TH_2P-P2.54-V-M]  52 4.25 0 top
U159  2.54-1*2  [HDR-TH_2P-P2.54-V-M]  52.01 101.5 180 top
U160  2.54-1*2  [HDR-TH_2P-P2.54-V-M]  114.25 20 270 bottom
U161  1N4007 M7  [SMA_L4.2-W2.7-LS5.3-RD]  98.25 14.2 225 bottom
U162  1N4007 M7  [SMA_L4.2-W2.7-LS5.3-RD]  75.75 14.2 225 bottom
U163  1N4007 M7  [SMA_L4.2-W2.7-LS5.3-RD]  40.75 14.2 225 bottom
U164  1N4007 M7  [SMA_L4.2-W2.7-LS5.3-RD]  18.25 14.2 225 bottom
U165  1N4007 M7  [SMA_L4.2-W2.7-LS5.3-RD]  98.25 39.2 225 bottom
U166  1N4007 M7  [SMA_L4.2-W2.7-LS5.3-RD]  75.75 39.2 225 bottom
U167  1N4007 M7  [SMA_L4.2-W2.7-LS5.3-RD]  40.75 39.2 225 bottom
U168  1N4007 M7  [SMA_L4.2-W2.7-LS5.3-RD]  18.25 39.2 225 bottom
U169  1N4007 M7  [SMA_L4.2-W2.7-LS5.3-RD]  98.25 64.2 225 bottom
U170  1N4007 M7  [SMA_L4.2-W2.7-LS5.3-RD]  75.75 64.2 225 bottom
U171  1N4007 M7  [SMA_L4.2-W2.7-LS5.3-RD]  40.75 64.2 225 bottom
U172  1N4007 M7  [SMA_L4.2-W2.7-LS5.3-RD]  18.25 64.2 225 bottom
U173  1N4007 M7  [SMA_L4.2-W2.7-LS5.3-RD]  98.25 89.2 225 bottom
U174  1N4007 M7  [SMA_L4.2-W2.7-LS5.3-RD]  75.75 89.2 225 bottom
U175  1N4007 M7  [SMA_L4.2-W2.7-LS5.3-RD]  40.75 89.2 225 bottom
U176  1N4007 M7  [SMA_L4.2-W2.7-LS5.3-RD]  18.25 89.2 225 bottom
U177  1N4007 M7  [SMA_L4.2-W2.7-LS5.3-RD]  87 13.95 315 bottom
U178  1N4007 M7  [SMA_L4.2-W2.7-LS5.3-RD]  64.5 13.95 315 bottom
U179  1N4007 M7  [SMA_L4.2-W2.7-LS5.3-RD]  29.5 13.95 315 bottom
U180  1N4007 M7  [SMA_L4.2-W2.7-LS5.3-RD]  7 13.95 315 bottom
U181  1N4007 M7  [SMA_L4.2-W2.7-LS5.3-RD]  87 38.95 315 bottom
U182  1N4007 M7  [SMA_L4.2-W2.7-LS5.3-RD]  64.5 38.95 315 bottom
U183  1N4007 M7  [SMA_L4.2-W2.7-LS5.3-RD]  29.5 38.95 315 bottom
U184  1N4007 M7  [SMA_L4.2-W2.7-LS5.3-RD]  7 38.95 315 bottom
U185  1N4007 M7  [SMA_L4.2-W2.7-LS5.3-RD]  87 63.95 315 bottom
U186  1N4007 M7  [SMA_L4.2-W2.7-LS5.3-RD]  64.5 63.95 315 bottom
U187  1N4007 M7  [SMA_L4.2-W2.7-LS5.3-RD]  29.5 63.95 315 bottom
U188  1N4007 M7  [SMA_L4.2-W2.7-LS5.3-RD]  7 63.95 315 bottom
U189  1N4007 M7  [SMA_L4.2-W2.7-LS5.3-RD]  87 88.95 315 bottom
U190  1N4007 M7  [SMA_L4.2-W2.7-LS5.3-RD]  64.5 88.95 315 bottom
U191  1N4007 M7  [SMA_L4.2-W2.7-LS5.3-RD]  29.5 88.95 315 bottom
U192  1N4007 M7  [SMA_L4.2-W2.7-LS5.3-RD]  7 88.95 315 bottom
U193  1N4007 M7  [SMA_L4.2-W2.7-LS5.3-RD]  92.25 25.45 180 bottom
U194  1N4007 M7  [SMA_L4.2-W2.7-LS5.3-RD]  69.75 25.45 180 bottom
U195  1N4007 M7  [SMA_L4.2-W2.7-LS5.3-RD]  34.75 25.45 180 bottom
U196  1N4007 M7  [SMA_L4.2-W2.7-LS5.3-RD]  12.25 25.45 180 bottom
U197  1N4007 M7  [SMA_L4.2-W2.7-LS5.3-RD]  92.25 50.45 180 bottom
U198  1N4007 M7  [SMA_L4.2-W2.7-LS5.3-RD]  69.75 50.45 180 bottom
U199  1N4007 M7  [SMA_L4.2-W2.7-LS5.3-RD]  34.75 50.45 180 bottom
U200  1N4007 M7  [SMA_L4.2-W2.7-LS5.3-RD]  12.25 50.45 180 bottom
U201  1N4007 M7  [SMA_L4.2-W2.7-LS5.3-RD]  92.25 75.45 180 bottom
U202  1N4007 M7  [SMA_L4.2-W2.7-LS5.3-RD]  69.75 75.45 180 bottom
U203  1N4007 M7  [SMA_L4.2-W2.7-LS5.3-RD]  34.75 75.45 180 bottom
U204  1N4007 M7  [SMA_L4.2-W2.7-LS5.3-RD]  12.25 75.45 180 bottom
U205  1N4007 M7  [SMA_L4.2-W2.7-LS5.3-RD]  92.25 100.45 180 bottom
U206  1N4007 M7  [SMA_L4.2-W2.7-LS5.3-RD]  69.75 100.45 180 bottom
U207  1N4007 M7  [SMA_L4.2-W2.7-LS5.3-RD]  34.75 100.45 180 bottom
U208  1N4007 M7  [SMA_L4.2-W2.7-LS5.3-RD]  12.25 100.45 180 bottom
U209  12pF  [C1206]  95.91 8.25 270 bottom
U210  12pF  [C1206]  73.41 8.25 270 bottom
U211  12pF  [C1206]  38.41 8.25 270 bottom
U212  12pF  [C1206]  15.91 8.25 270 bottom
U213  12pF  [C1206]  95.91 33.25 270 bottom
U214  12pF  [C1206]  73.41 33.25 270 bottom
U215  12pF  [C1206]  38.41 33.25 270 bottom
U216  12pF  [C1206]  15.91 33.25 270 bottom
U217  12pF  [C1206]  95.91 58.25 270 bottom
U218  12pF  [C1206]  73.41 58.25 270 bottom
U219  12pF  [C1206]  38.41 58.25 270 bottom
U220  12pF  [C1206]  15.91 58.25 270 bottom
U221  12pF  [C1206]  95.91 83.25 270 bottom
U222  12pF  [C1206]  73.41 83.25 270 bottom
U223  12pF  [C1206]  38.41 83.25 270 bottom
U224  12pF  [C1206]  15.91 83.25 270 bottom
U225  12pF  [C1206]  89.29 8.25 270 bottom
U226  12pF  [C1206]  66.79 8.25 270 bottom
U227  12pF  [C1206]  31.79 8.25 270 bottom
U228  12pF  [C1206]  9.29 8.25 270 bottom
U229  12pF  [C1206]  89.29 33.25 270 bottom
U230  12pF  [C1206]  66.79 33.25 270 bottom
U231  12pF  [C1206]  31.79 33.25 270 bottom
U232  12pF  [C1206]  9.29 33.25 270 bottom
U233  12pF  [C1206]  89.29 58.25 270 bottom
U234  12pF  [C1206]  66.79 58.25 270 bottom
U235  12pF  [C1206]  31.79 58.25 270 bottom
U236  12pF  [C1206]  9.29 58.25 270 bottom
U237  12pF  [C1206]  89.29 83.25 270 bottom
U238  12pF  [C1206]  66.79 83.25 270 bottom
U239  12pF  [C1206]  31.79 83.25 270 bottom
U240  12pF  [C1206]  9.29 83.25 270 bottom
U241  TL084CDR  [SOIC-14_L8.7-W3.9-P1.27-LS6.0-BL]  92.5 19.7 180 bottom
U242  TL084CDR  [SOIC-14_L8.7-W3.9-P1.27-LS6.0-BL]  70 19.7 180 bottom
U243  TL084CDR  [SOIC-14_L8.7-W3.9-P1.27-LS6.0-BL]  35 19.7 180 bottom
U244  TL084CDR  [SOIC-14_L8.7-W3.9-P1.27-LS6.0-BL]  12.5 19.7 180 bottom
U245  TL084CDR  [SOIC-14_L8.7-W3.9-P1.27-LS6.0-BL]  92.5 44.7 180 bottom
U246  TL084CDR  [SOIC-14_L8.7-W3.9-P1.27-LS6.0-BL]  70 44.7 180 bottom
U247  TL084CDR  [SOIC-14_L8.7-W3.9-P1.27-LS6.0-BL]  35 44.7 180 bottom
U248  TL084CDR  [SOIC-14_L8.7-W3.9-P1.27-LS6.0-BL]  12.5 44.7 180 bottom
U249  TL084CDR  [SOIC-14_L8.7-W3.9-P1.27-LS6.0-BL]  92.5 69.7 180 bottom
U250  TL084CDR  [SOIC-14_L8.7-W3.9-P1.27-LS6.0-BL]  70 69.7 180 bottom
U251  TL084CDR  [SOIC-14_L8.7-W3.9-P1.27-LS6.0-BL]  35 69.7 180 bottom
U252  TL084CDR  [SOIC-14_L8.7-W3.9-P1.27-LS6.0-BL]  12.5 69.7 180 bottom
U253  TL084CDR  [SOIC-14_L8.7-W3.9-P1.27-LS6.0-BL]  92.5 94.7 180 bottom
U254  TL084CDR  [SOIC-14_L8.7-W3.9-P1.27-LS6.0-BL]  70 94.7 180 bottom
U255  TL084CDR  [SOIC-14_L8.7-W3.9-P1.27-LS6.0-BL]  35 94.7 180 bottom
U256  TL084CDR  [SOIC-14_L8.7-W3.9-P1.27-LS6.0-BL]  12.5 94.7 180 bottom
U257  PCA9685PW,112  [TSSOP-28_L9.7-W4.4-P0.65-LS6.4-BL]  53 29.5 270 bottom
U258  PCA9685PW,112  [TSSOP-28_L9.7-W4.4-P0.65-LS6.4-BL]  53 79.5 270 bottom

## Footprints (pads in the part's own frame, mm; a bottom-side part is the same pattern mirrored in y, then rotated)
C1206
  rect 1.485x1.728 smd: 1(-1.593,0) 2(1.593,0)
HDR-TH_2P-P2.54-V-M
  rect 2x2 hole 1.2: 1(-1.27,0)
  round 2 hole 1.2: 2(1.27,0)
R1206
  rect 1.208x1.701 smd: 1(-1.479,0) 2(1.479,0)
SMA_L4.2-W2.7-LS5.3-RD
  rect 2.046x1.62 smd: 1(-2.16,0) 2(2.16,0)
SOIC-14_L8.7-W3.9-P1.27-LS6.0-BL
  oval 0.574x2.038 smd: 1(-3.81,-2.769) 2(-2.54,-2.769) 3(-1.27,-2.769) 4(0,-2.769) 5(1.27,-2.769) 6(2.54,-2.769) 7(3.81,-2.769) 8(3.81,2.769) 9(2.54,2.769) 10(1.27,2.769) 11(0,2.769) 12(-1.27,2.769) 13(-2.54,2.769) 14(-3.81,2.769)
TSSOP-28_L9.7-W4.4-P0.65-LS6.4-BL
  oval 0.343x1.732 smd: 1(-4.225,-2.866) 2(-3.575,-2.866) 3(-2.925,-2.866) 4(-2.275,-2.866) 5(-1.625,-2.866) 6(-0.975,-2.866) 7(-0.325,-2.866) 8(0.325,-2.866) 9(0.975,-2.866) 10(1.625,-2.866) 11(2.275,-2.866) 12(2.925,-2.866) 13(3.575,-2.866) 14(4.225,-2.866) 15(4.225,2.866) 16(3.575,2.866) 17(2.925,2.866) 18(2.275,2.866) 19(1.625,2.866) 20(0.975,2.866) 21(0.325,2.866) 22(-0.325,2.866) 23(-0.975,2.866) 24(-1.625,2.866) 25(-2.275,2.866) 26(-2.925,2.866) 27(-3.575,2.866) 28(-4.225,2.866)

## Nets
+5V: R2.2 U6.4 U10.4 U11.1 U11.2 U11.3 U11.4 U11.5 U11.24 U11.28 U14.4 U72.1 U72.2 U72.3 U72.4 U72.5 U72.24 U72.28 U83.4 U84.4 U105.4 U106.4 U107.4 U108.4 U149.4 U150.4 U151.4 U152.4 U153.4 U154.4 U155.4 U156.4 U157.1 U158.1 U241.4 U242.4 U243.4 U244.4 U245.4 U246.4 U247.4 U248.4 U249.4 U250.4 U251.4 U252.4 U253.4 U254.4 U255.4 U256.4 U257.1 U257.2 U257.3 U257.4 U257.5 U257.24 U257.28 U258.1 U258.2 U258.3 U258.4 U258.5 U258.24 U258.28
GND: R1.1 Rb.1 U1.1 U2.1 U6.11 U10.11 U11.14 U12.1 U13.1 U14.11 U72.14 U79.1 U80.1 U81.1 U82.1 U83.11 U84.11 U97.1 U98.1 U99.1 U100.1 U101.1 U102.1 U103.1 U104.1 U105.11 U106.11 U107.11 U108.11 U133.1 U134.1 U135.1 U136.1 U137.1 U138.1 U139.1 U140.1 U141.1 U142.1 U143.1 U144.1 U145.1 U146.1 U147.1 U148.1 U149.11 U150.11 U151.11 U152.11 U153.11 U154.11 U155.11 U156.11 U157.2 U158.2 U209.1 U210.1 U211.1 U212.1 U213.1 U214.1 U215.1 U216.1 U217.1 U218.1 U219.1 U220.1 U221.1 U222.1 U223.1 U224.1 U225.1 U226.1 U227.1 U228.1 U229.1 U230.1 U231.1 U232.1 U233.1 U234.1 U235.1 U236.1 U237.1 U238.1 U239.1 U240.1 U241.11 U242.11 U243.11 U244.11 U245.11 U246.11 U247.11 U248.11 U249.11 U250.11 U251.11 U252.11 U253.11 U254.11 U255.11 U256.11 U257.14 U258.14
I2C_SCL: U11.26 U72.26 U159.2 U257.26 U258.26
I2C_SDA: U11.27 U72.27 U159.1 U257.27 U258.27
INT0: R3.1 U1.2 U11.13
INT1: R17.1 U11.11 U12.2
INT2: R314.1 U11.18 U79.2
INT3: R315.1 U11.16 U80.2
INT4: R342.1 U11.9 U97.2
INT5: R343.1 U11.7 U98.2
INT6: R344.1 U11.22 U99.2
INT7: R345.1 U11.20 U100.2
INT8: R405.1 U72.13 U140.2
INT9: R404.1 U72.11 U139.2
INT10: R403.1 U72.18 U138.2
INT11: R402.1 U72.16 U137.2
INT12: R398.1 U72.9 U133.2
INT13: R399.1 U72.7 U134.2
INT14: R400.1 U72.22 U135.2
INT15: R401.1 U72.20 U136.2
INT16: R510.1 U209.2 U257.13
INT17: R511.1 U210.2 U257.11
INT18: R512.1 U211.2 U257.18
INT19: R513.1 U212.2 U257.16
INT20: R514.1 U213.2 U257.9
INT21: R515.1 U214.2 U257.7
INT22: R516.1 U215.2 U257.22
INT23: R517.1 U216.2 U257.20
INT24: R518.1 U217.2 U258.13
INT25: R519.1 U218.2 U258.11
INT26: R520.1 U219.2 U258.18
INT27: R521.1 U220.2 U258.16
INT28: R522.1 U221.2 U258.9
INT29: R523.1 U222.2 U258.7
INT30: R524.1 U223.2 U258.22
INT31: R525.1 U224.2 U258.20
VADD: R172.1 R175.1 R192.1 R193.1 R226.1 R227.1 R228.1 R229.1 R294.1 R295.1 R296.1 R297.1 R298.1 R299.1 R300.1 R301.1 R542.1 R543.1 R544.1 R545.1 R546.1 R547.1 R548.1 R549.1 R550.1 R551.1 R552.1 R553.1 R554.1 R555.1 R556.1 R557.1 U10.3
VGND: R1.2 R2.1 U6.3 U6.5 U6.10 U6.12 U14.3 U14.5 U14.10 U14.12 U83.3 U83.5 U83.10 U83.12 U84.3 U84.5 U84.10 U84.12 U105.3 U105.5 U105.10 U105.12 U106.3 U106.5 U106.10 U106.12 U107.3 U107.5 U107.10 U107.12 U108.3 U108.5 U108.10 U108.12 U149.3 U149.5 U149.10 U149.12 U150.3 U150.5 U150.10 U150.12 U151.3 U151.5 U151.10 U151.12 U152.3 U152.5 U152.10 U152.12 U153.3 U153.5 U153.10 U153.12 U154.3 U154.5 U154.10 U154.12 U155.3 U155.5 U155.10 U155.12 U156.3 U156.5 U156.10 U156.12 U241.3 U241.5 U241.10 U241.12 U242.3 U242.5 U242.10 U242.12 U243.3 U243.5 U243.10 U243.12 U244.3 U244.5 U244.10 U244.12 U245.3 U245.5 U245.10 U245.12 U246.3 U246.5 U246.10 U246.12 U247.3 U247.5 U247.10 U247.12 U248.3 U248.5 U248.10 U248.12 U249.3 U249.5 U249.10 U249.12 U250.3 U250.5 U250.10 U250.12 U251.3 U251.5 U251.10 U251.12 U252.3 U252.5 U252.10 U252.12 U253.3 U253.5 U253.10 U253.12 U254.3 U254.5 U254.10 U254.12 U255.3 U255.5 U255.10 U255.12 U256.3 U256.5 U256.10 U256.12
VOUT: Ra.2 U10.1
WEIGHT0: R4.1 U2.2 U11.12
WEIGHT1: R18.1 U11.10 U13.2
WEIGHT2: R316.1 U11.17 U81.2
WEIGHT3: R317.1 U11.15 U82.2
WEIGHT4: R346.1 U11.8 U101.2
WEIGHT5: R347.1 U11.6 U102.2
WEIGHT6: R348.1 U11.21 U103.2
WEIGHT7: R349.1 U11.19 U104.2
WEIGHT8: R413.1 U72.12 U148.2
WEIGHT9: R412.1 U72.10 U147.2
WEIGHT10: R411.1 U72.17 U146.2
WEIGHT11: R410.1 U72.15 U145.2
WEIGHT12: R406.1 U72.8 U141.2
WEIGHT13: R407.1 U72.6 U142.2
WEIGHT14: R408.1 U72.21 U143.2
WEIGHT15: R409.1 U72.19 U144.2
WEIGHT16: R526.1 U225.2 U257.12
WEIGHT17: R527.1 U226.2 U257.10
WEIGHT18: R528.1 U227.2 U257.17
WEIGHT19: R529.1 U228.2 U257.15
WEIGHT20: R530.1 U229.2 U257.8
WEIGHT21: R531.1 U230.2 U257.6
WEIGHT22: R532.1 U231.2 U257.21
WEIGHT23: R533.1 U232.2 U257.19
WEIGHT24: R534.1 U233.2 U258.12
WEIGHT25: R535.1 U234.2 U258.10
WEIGHT26: R536.1 U235.2 U258.17
WEIGHT27: R537.1 U236.2 U258.15
WEIGHT28: R538.1 U237.2 U258.8
WEIGHT29: R539.1 U238.2 U258.6
WEIGHT30: R540.1 U239.2 U258.21
WEIGHT31: R541.1 U240.2 U258.19
$1I11116/$1N1615: R7.1 U6.2 U7.2
$1I11116/$1N1657: R8.1 U6.6 U8.2
$1I11116/$1N1729: R10.2 U6.7 U8.1
$1I11116/$1N1735: R9.2 U6.1 U7.1
$1I11116/$1N1793: R9.1 R10.1 R11.2 U6.9
$1I11116/$1N1839: R11.1 U6.8 U9.2
$1I11116/$1N1881: R12.2 U6.13 U9.1
$1I11116/$1N17644: R3.2 R7.2
$1I11116/$1N17777: R4.2 R8.2
$1I11246/$1N1615: R5.1 U3.2 U14.2
$1I11246/$1N1657: R6.1 U4.2 U14.6
$1I11246/$1N1729: R14.2 U4.1 U14.7
$1I11246/$1N1735: R13.2 U3.1 U14.1
$1I11246/$1N1793: R13.1 R14.1 R15.2 U14.9
$1I11246/$1N1839: R15.1 U5.2 U14.8
$1I11246/$1N1881: R16.2 U5.1 U14.13
$1I11246/$1N17644: R5.2 R17.2
$1I11246/$1N17777: R6.2 R18.2
$1I11278/$1N1615: R302.1 U73.2 U83.2
$1I11278/$1N1657: R304.1 U75.2 U83.6
$1I11278/$1N1729: R308.2 U75.1 U83.7
$1I11278/$1N1735: R306.2 U73.1 U83.1
$1I11278/$1N1793: R306.1 R308.1 R310.2 U83.9
$1I11278/$1N1839: R310.1 U77.2 U83.8
$1I11278/$1N1881: R312.2 U77.1 U83.13
$1I11278/$1N17644: R302.2 R314.2
$1I11278/$1N17777: R304.2 R316.2
$1I11305/$1N1615: R303.1 U74.2 U84.2
$1I11305/$1N1657: R305.1 U76.2 U84.6
$1I11305/$1N1729: R309.2 U76.1 U84.7
$1I11305/$1N1735: R307.2 U74.1 U84.1
$1I11305/$1N1793: R307.1 R309.1 R311.2 U84.9
$1I11305/$1N1839: R311.1 U78.2 U84.8
$1I11305/$1N1881: R313.2 U78.1 U84.13
$1I11305/$1N17644: R303.2 R315.2
$1I11305/$1N17777: R305.2 R317.2
$1I11342/$1N1615: R318.1 U85.2 U105.2
$1I11342/$1N1657: R322.1 U89.2 U105.6
$1I11342/$1N1729: R330.2 U89.1 U105.7
$1I11342/$1N1735: R326.2 U85.1 U105.1
$1I11342/$1N1793: R326.1 R330.1 R334.2 U105.9
$1I11342/$1N1839: R334.1 U93.2 U105.8
$1I11342/$1N1881: R338.2 U93.1 U105.13
$1I11342/$1N17644: R318.2 R342.2
$1I11342/$1N17777: R322.2 R346.2
$1I11369/$1N1615: R319.1 U86.2 U106.2
$1I11369/$1N1657: R323.1 U90.2 U106.6
$1I11369/$1N1729: R331.2 U90.1 U106.7
$1I11369/$1N1735: R327.2 U86.1 U106.1
$1I11369/$1N1793: R327.1 R331.1 R335.2 U106.9
$1I11369/$1N1839: R335.1 U94.2 U106.8
$1I11369/$1N1881: R339.2 U94.1 U106.13
$1I11369/$1N17644: R319.2 R343.2
$1I11369/$1N17777: R323.2 R347.2
$1I11396/$1N1615: R320.1 U87.2 U107.2
$1I11396/$1N1657: R324.1 U91.2 U107.6
$1I11396/$1N1729: R332.2 U91.1 U107.7
$1I11396/$1N1735: R328.2 U87.1 U107.1
$1I11396/$1N1793: R328.1 R332.1 R336.2 U107.9
$1I11396/$1N1839: R336.1 U95.2 U107.8
$1I11396/$1N1881: R340.2 U95.1 U107.13
$1I11396/$1N17644: R320.2 R344.2
$1I11396/$1N17777: R324.2 R348.2
$1I11423/$1N1615: R321.1 U88.2 U108.2
$1I11423/$1N1657: R325.1 U92.2 U108.6
$1I11423/$1N1729: R333.2 U92.1 U108.7
$1I11423/$1N1735: R329.2 U88.1 U108.1
$1I11423/$1N1793: R329.1 R333.1 R337.2 U108.9
$1I11423/$1N1839: R337.1 U96.2 U108.8
$1I11423/$1N1881: R341.2 U96.1 U108.13
$1I11423/$1N17644: R321.2 R345.2
$1I11423/$1N17777: R325.2 R349.2
$1I11470/$1N1615: R350.1 U109.2 U149.2
$1I11470/$1N1657: R358.1 U117.2 U149.6
$1I11470/$1N1729: R374.2 U117.1 U149.7
$1I11470/$1N1735: R366.2 U109.1 U149.1
$1I11470/$1N1793: R366.1 R374.1 R382.2 U149.9
$1I11470/$1N1839: R382.1 U125.2 U149.8
$1I11470/$1N1881: R390.2 U125.1 U149.13
$1I11470/$1N17644: R350.2 R398.2
$1I11470/$1N17777: R358.2 R406.2
$1I11497/$1N1615: R351.1 U110.2 U150.2
$1I11497/$1N1657: R359.1 U118.2 U150.6
$1I11497/$1N1729: R375.2 U118.1 U150.7
$1I11497/$1N1735: R367.2 U110.1 U150.1
$1I11497/$1N1793: R367.1 R375.1 R383.2 U150.9
$1I11497/$1N1839: R383.1 U126.2 U150.8
$1I11497/$1N1881: R391.2 U126.1 U150.13
$1I11497/$1N17644: R351.2 R399.2
$1I11497/$1N17777: R359.2 R407.2
$1I11524/$1N1615: R352.1 U111.2 U151.2
$1I11524/$1N1657: R360.1 U119.2 U151.6
$1I11524/$1N1729: R376.2 U119.1 U151.7
$1I11524/$1N1735: R368.2 U111.1 U151.1
$1I11524/$1N1793: R368.1 R376.1 R384.2 U151.9
$1I11524/$1N1839: R384.1 U127.2 U151.8
$1I11524/$1N1881: R392.2 U127.1 U151.13
$1I11524/$1N17644: R352.2 R400.2
$1I11524/$1N17777: R360.2 R408.2
$1I11551/$1N1615: R353.1 U112.2 U152.2
$1I11551/$1N1657: R361.1 U120.2 U152.6
$1I11551/$1N1729: R377.2 U120.1 U152.7
$1I11551/$1N1735: R369.2 U112.1 U152.1
$1I11551/$1N1793: R369.1 R377.1 R385.2 U152.9
$1I11551/$1N1839: R385.1 U128.2 U152.8
$1I11551/$1N1881: R393.2 U128.1 U152.13
$1I11551/$1N17644: R353.2 R401.2
$1I11551/$1N17777: R361.2 R409.2
$1I11578/$1N1615: R354.1 U113.2 U153.2
$1I11578/$1N1657: R362.1 U121.2 U153.6
$1I11578/$1N1729: R378.2 U121.1 U153.7
$1I11578/$1N1735: R370.2 U113.1 U153.1
$1I11578/$1N1793: R370.1 R378.1 R386.2 U153.9
$1I11578/$1N1839: R386.1 U129.2 U153.8
$1I11578/$1N1881: R394.2 U129.1 U153.13
$1I11578/$1N17644: R354.2 R402.2
$1I11578/$1N17777: R362.2 R410.2
$1I11605/$1N1615: R355.1 U114.2 U154.2
$1I11605/$1N1657: R363.1 U122.2 U154.6
$1I11605/$1N1729: R379.2 U122.1 U154.7
$1I11605/$1N1735: R371.2 U114.1 U154.1
$1I11605/$1N1793: R371.1 R379.1 R387.2 U154.9
$1I11605/$1N1839: R387.1 U130.2 U154.8
$1I11605/$1N1881: R395.2 U130.1 U154.13
$1I11605/$1N17644: R355.2 R403.2
$1I11605/$1N17777: R363.2 R411.2
$1I11632/$1N1615: R356.1 U115.2 U155.2
$1I11632/$1N1657: R364.1 U123.2 U155.6
$1I11632/$1N1729: R380.2 U123.1 U155.7
$1I11632/$1N1735: R372.2 U115.1 U155.1
$1I11632/$1N1793: R372.1 R380.1 R388.2 U155.9
$1I11632/$1N1839: R388.1 U131.2 U155.8
$1I11632/$1N1881: R396.2 U131.1 U155.13
$1I11632/$1N17644: R356.2 R404.2
$1I11632/$1N17777: R364.2 R412.2
$1I11659/$1N1615: R357.1 U116.2 U156.2
$1I11659/$1N1657: R365.1 U124.2 U156.6
$1I11659/$1N1729: R381.2 U124.1 U156.7
$1I11659/$1N1735: R373.2 U116.1 U156.1
$1I11659/$1N1793: R373.1 R381.1 R389.2 U156.9
$1I11659/$1N1839: R389.1 U132.2 U156.8
$1I11659/$1N1881: R397.2 U132.1 U156.13
$1I11659/$1N17644: R357.2 R405.2
$1I11659/$1N17777: R365.2 R413.2
$1I12647/$1N1615: R414.1 U161.2 U241.2
$1I12647/$1N1657: R430.1 U177.2 U241.6
$1I12647/$1N1729: R462.2 U177.1 U241.7
$1I12647/$1N1735: R446.2 U161.1 U241.1
$1I12647/$1N1793: R446.1 R462.1 R478.2 U241.9
$1I12647/$1N1839: R478.1 U193.2 U241.8
$1I12647/$1N1881: R494.2 U193.1 U241.13
$1I12647/$1N17644: R414.2 R510.2
$1I12647/$1N17777: R430.2 R526.2
$1I12674/$1N1615: R415.1 U162.2 U242.2
$1I12674/$1N1657: R431.1 U178.2 U242.6
$1I12674/$1N1729: R463.2 U178.1 U242.7
$1I12674/$1N1735: R447.2 U162.1 U242.1
$1I12674/$1N1793: R447.1 R463.1 R479.2 U242.9
$1I12674/$1N1839: R479.1 U194.2 U242.8
$1I12674/$1N1881: R495.2 U194.1 U242.13
$1I12674/$1N17644: R415.2 R511.2
$1I12674/$1N17777: R431.2 R527.2
$1I12701/$1N1615: R416.1 U163.2 U243.2
$1I12701/$1N1657: R432.1 U179.2 U243.6
$1I12701/$1N1729: R464.2 U179.1 U243.7
$1I12701/$1N1735: R448.2 U163.1 U243.1
$1I12701/$1N1793: R448.1 R464.1 R480.2 U243.9
$1I12701/$1N1839: R480.1 U195.2 U243.8
$1I12701/$1N1881: R496.2 U195.1 U243.13
$1I12701/$1N17644: R416.2 R512.2
$1I12701/$1N17777: R432.2 R528.2
$1I12728/$1N1615: R417.1 U164.2 U244.2
$1I12728/$1N1657: R433.1 U180.2 U244.6
$1I12728/$1N1729: R465.2 U180.1 U244.7
$1I12728/$1N1735: R449.2 U164.1 U244.1
$1I12728/$1N1793: R449.1 R465.1 R481.2 U244.9
$1I12728/$1N1839: R481.1 U196.2 U244.8
$1I12728/$1N1881: R497.2 U196.1 U244.13
$1I12728/$1N17644: R417.2 R513.2
$1I12728/$1N17777: R433.2 R529.2
$1I12755/$1N1615: R418.1 U165.2 U245.2
$1I12755/$1N1657: R434.1 U181.2 U245.6
$1I12755/$1N1729: R466.2 U181.1 U245.7
$1I12755/$1N1735: R450.2 U165.1 U245.1
$1I12755/$1N1793: R450.1 R466.1 R482.2 U245.9
$1I12755/$1N1839: R482.1 U197.2 U245.8
$1I12755/$1N1881: R498.2 U197.1 U245.13
$1I12755/$1N17644: R418.2 R514.2
$1I12755/$1N17777: R434.2 R530.2
$1I12782/$1N1615: R419.1 U166.2 U246.2
$1I12782/$1N1657: R435.1 U182.2 U246.6
$1I12782/$1N1729: R467.2 U182.1 U246.7
$1I12782/$1N1735: R451.2 U166.1 U246.1
$1I12782/$1N1793: R451.1 R467.1 R483.2 U246.9
$1I12782/$1N1839: R483.1 U198.2 U246.8
$1I12782/$1N1881: R499.2 U198.1 U246.13
$1I12782/$1N17644: R419.2 R515.2
$1I12782/$1N17777: R435.2 R531.2
$1I12809/$1N1615: R420.1 U167.2 U247.2
$1I12809/$1N1657: R436.1 U183.2 U247.6
$1I12809/$1N1729: R468.2 U183.1 U247.7
$1I12809/$1N1735: R452.2 U167.1 U247.1
$1I12809/$1N1793: R452.1 R468.1 R484.2 U247.9
$1I12809/$1N1839: R484.1 U199.2 U247.8
$1I12809/$1N1881: R500.2 U199.1 U247.13
$1I12809/$1N17644: R420.2 R516.2
$1I12809/$1N17777: R436.2 R532.2
$1I12836/$1N1615: R421.1 U168.2 U248.2
$1I12836/$1N1657: R437.1 U184.2 U248.6
$1I12836/$1N1729: R469.2 U184.1 U248.7
$1I12836/$1N1735: R453.2 U168.1 U248.1
$1I12836/$1N1793: R453.1 R469.1 R485.2 U248.9
$1I12836/$1N1839: R485.1 U200.2 U248.8
$1I12836/$1N1881: R501.2 U200.1 U248.13
$1I12836/$1N17644: R421.2 R517.2
$1I12836/$1N17777: R437.2 R533.2
$1I12863/$1N1615: R422.1 U169.2 U249.2
$1I12863/$1N1657: R438.1 U185.2 U249.6
$1I12863/$1N1729: R470.2 U185.1 U249.7
$1I12863/$1N1735: R454.2 U169.1 U249.1
$1I12863/$1N1793: R454.1 R470.1 R486.2 U249.9
$1I12863/$1N1839: R486.1 U201.2 U249.8
$1I12863/$1N1881: R502.2 U201.1 U249.13
$1I12863/$1N17644: R422.2 R518.2
$1I12863/$1N17777: R438.2 R534.2
$1I12890/$1N1615: R423.1 U170.2 U250.2
$1I12890/$1N1657: R439.1 U186.2 U250.6
$1I12890/$1N1729: R471.2 U186.1 U250.7
$1I12890/$1N1735: R455.2 U170.1 U250.1
$1I12890/$1N1793: R455.1 R471.1 R487.2 U250.9
$1I12890/$1N1839: R487.1 U202.2 U250.8
$1I12890/$1N1881: R503.2 U202.1 U250.13
$1I12890/$1N17644: R423.2 R519.2
$1I12890/$1N17777: R439.2 R535.2
$1I12917/$1N1615: R424.1 U171.2 U251.2
$1I12917/$1N1657: R440.1 U187.2 U251.6
$1I12917/$1N1729: R472.2 U187.1 U251.7
$1I12917/$1N1735: R456.2 U171.1 U251.1
$1I12917/$1N1793: R456.1 R472.1 R488.2 U251.9
$1I12917/$1N1839: R488.1 U203.2 U251.8
$1I12917/$1N1881: R504.2 U203.1 U251.13
$1I12917/$1N17644: R424.2 R520.2
$1I12917/$1N17777: R440.2 R536.2
$1I12944/$1N1615: R425.1 U172.2 U252.2
$1I12944/$1N1657: R441.1 U188.2 U252.6
$1I12944/$1N1729: R473.2 U188.1 U252.7
$1I12944/$1N1735: R457.2 U172.1 U252.1
$1I12944/$1N1793: R457.1 R473.1 R489.2 U252.9
$1I12944/$1N1839: R489.1 U204.2 U252.8
$1I12944/$1N1881: R505.2 U204.1 U252.13
$1I12944/$1N17644: R425.2 R521.2
$1I12944/$1N17777: R441.2 R537.2
$1I12971/$1N1615: R426.1 U173.2 U253.2
$1I12971/$1N1657: R442.1 U189.2 U253.6
$1I12971/$1N1729: R474.2 U189.1 U253.7
$1I12971/$1N1735: R458.2 U173.1 U253.1
$1I12971/$1N1793: R458.1 R474.1 R490.2 U253.9
$1I12971/$1N1839: R490.1 U205.2 U253.8
$1I12971/$1N1881: R506.2 U205.1 U253.13
$1I12971/$1N17644: R426.2 R522.2
$1I12971/$1N17777: R442.2 R538.2
$1I12998/$1N1615: R427.1 U174.2 U254.2
$1I12998/$1N1657: R443.1 U190.2 U254.6
$1I12998/$1N1729: R475.2 U190.1 U254.7
$1I12998/$1N1735: R459.2 U174.1 U254.1
$1I12998/$1N1793: R459.1 R475.1 R491.2 U254.9
$1I12998/$1N1839: R491.1 U206.2 U254.8
$1I12998/$1N1881: R507.2 U206.1 U254.13
$1I12998/$1N17644: R427.2 R523.2
$1I12998/$1N17777: R443.2 R539.2
$1I13025/$1N1615: R428.1 U175.2 U255.2
$1I13025/$1N1657: R444.1 U191.2 U255.6
$1I13025/$1N1729: R476.2 U191.1 U255.7
$1I13025/$1N1735: R460.2 U175.1 U255.1
$1I13025/$1N1793: R460.1 R476.1 R492.2 U255.9
$1I13025/$1N1839: R492.1 U207.2 U255.8
$1I13025/$1N1881: R508.2 U207.1 U255.13
$1I13025/$1N17644: R428.2 R524.2
$1I13025/$1N17777: R444.2 R540.2
$1I13052/$1N1615: R429.1 U176.2 U256.2
$1I13052/$1N1657: R445.1 U192.2 U256.6
$1I13052/$1N1729: R477.2 U192.1 U256.7
$1I13052/$1N1735: R461.2 U176.1 U256.1
$1I13052/$1N1793: R461.1 R477.1 R493.2 U256.9
$1I13052/$1N1839: R493.1 U208.2 U256.8
$1I13052/$1N1881: R509.2 U208.1 U256.13
$1I13052/$1N17644: R429.2 R525.2
$1I13052/$1N17777: R445.2 R541.2
$1N295: Ra.1 Rb.2 U10.2
$1N11143: R12.1 R172.2 U6.14
$1N11273: R16.1 R175.2 U14.14
$1N11332: R192.2 R312.1 U83.14
$1N11336: R193.2 R313.1 U84.14
$1N11450: R226.2 R338.1 U105.14
$1N11454: R227.2 R339.1 U106.14
$1N11458: R228.2 R340.1 U107.14
$1N11462: R229.2 R341.1 U108.14
$1N11686: R298.2 R390.1 U149.14
$1N11690: R299.2 R391.1 U150.14
$1N11694: R300.2 R392.1 U151.14
$1N11698: R301.2 R393.1 U152.14
$1N11702: R297.2 R394.1 U153.14
$1N11706: R296.2 R395.1 U154.14
$1N11710: R295.2 R396.1 U155.14
$1N11714: R294.2 R397.1 U156.14
$1N13271: R494.1 R542.2 U241.14
$1N13275: R495.1 R543.2 U242.14
$1N13279: R496.1 R544.2 U243.14
$1N13283: R497.1 R545.2 U244.14
$1N13287: R498.1 R546.2 U245.14
$1N13291: R499.1 R547.2 U246.14
$1N13295: R500.1 R548.2 U247.14
$1N13299: R501.1 R549.2 U248.14
$1N13303: R506.1 R554.2 U253.14
$1N13307: R507.1 R555.2 U254.14
$1N13311: R508.1 R556.2 U255.14
$1N13315: R509.1 R557.2 U256.14
$1N13319: R505.1 R553.2 U252.14
$1N13323: R504.1 R552.2 U251.14
$1N13327: R503.1 R551.2 U250.14
$1N13331: R502.1 R550.2 U249.14

Pads without a net: U10 5 6 7 8 9 10 12 13 14; U11 23 25; U72 23 25; U160 1 2; U257 23 25; U258 23 25

## Via types
v1: diameter 0.61, hole 0.305, Top Layer to Bottom Layer, 174 vias

## Routing (per net, layer and track width the routed paths; a pad name or vN(x,y) marks a point on that pad's centre or on a via; arc(x,y) is an arc through that point)
+5V: length 14.5
  Top Layer w0.25: v1(57.5,81.5) 57.12,81.12 U72.24 ; U72.28 57.28,83.72 v1(57.5,83.5)
  Top Layer w1: U158.1 U157.1 50.82,6.84 R2.2
  vias: v1(12.5,92) v1(12.5,66.93) v1(12.5,42) v1(12.5,17) v1(35,92) v1(35,66.93) v1(35,42) v1(35,17) v1(47,84) v1(47,83) v1(47,82) v1(48,34) v1(48,33) v1(48,32) v1(53.27,92) v1(57.5,82.5) v1(57.5,34) v1(57.5,33) v1(57.5,32) v1(70,92) v1(70,67) v1(70,42) v1(70,17) v1(92.5,92) v1(92.5,67) v1(92.52,41.96) v1(92.5,17)
GND: length 5.5
  Top Layer w0.25: U11.14 50.11,24.5 v1(50.5,24.5) ; v1(49.5,74.5) 49.41,74.5 U72.14
  Bottom Layer w0.25: v1(55,74.5) 55.78,75.28 U258.14 ; U257.14 55.09,24.5 v1(54.5,24.5)
  vias: v1(9.09,84.87) v1(9.09,59.87) v1(9.09,34.87) v1(9.09,9.87) v1(12.5,97.5) v1(12.5,72.47) v1(12.5,47.5) v1(12.5,22.5) v1(15.71,84.87) v1(15.71,59.87) v1(15.71,34.87) v1(15.71,9.87) v1(31.59,84.87) v1(31.59,59.87) v1(31.59,34.87) v1(31.59,9.87) v1(35,97.5) v1(35,72.47) v1(35,47.5) v1(35,22.5) v1(38.21,84.87) v1(38.21,59.87) v1(38.21,34.87) v1(38.21,9.87) v1(47.73,92) v1(50.82,14.4) v1(57.8,86.52) v1(66.59,84.87) v1(66.59,59.87) v1(66.59,34.87) v1(66.59,9.87) v1(70,97.5) v1(70,72.5) v1(70,47.5) v1(70,22.5) v1(73.21,84.87) v1(73.21,59.87) v1(73.21,34.87) v1(73.21,9.87) v1(89.09,84.87) v1(89.09,59.87) v1(89.09,34.87) v1(89.09,9.87) v1(92.5,97.5) v1(92.5,72.5) v1(92.5,47.5) v1(92.5,22.5) v1(95.71,84.87) v1(95.71,59.87) v1(95.71,34.87) v1(95.71,9.87)
I2C_SCL: length 80.9
  Top Layer w0.25: U11.26 v1(51.68,32.42) 50.7,33.4 50.7,84 ; U159.2 50.7,101.46 50.7,84 ; U72.26 v1(52.28,82.42) 50.7,84
  Bottom Layer w0.25: v1(51.68,32.42) U257.26 ; v1(52.28,82.42) U258.26
I2C_SDA: length 79.8
  Top Layer w0.25: v1(52.2,33.1) 55.04,33.1 U11.27 ; U72.27 52.91,83.08 v1(52.28,83.7) 51.5,84.48 51.5,99.72 U159.1
  Bottom Layer w0.25: U257.27 52.18,33.08 v1(52.2,33.1) 53,33.9 53,82.98 v1(52.28,83.7) 51.65,83.08 U258.27
INT0: length 69
  Top Layer w0.25: U11.13 48.32,25.93 47.1,24.7 47.1,4 44.7,1.6 10.3,1.6 8.84,3.06 8.84,6.69
  Top Layer w1.5: U1.2 11.14,6.69
INT1: length 43.9
  Top Layer w0.25: 31.34,6.69 31.34,4.46 32.3,3.5 42.9,3.5 45.3,5.9 45.3,25.43 47.09,27.22 U11.11
  Top Layer w1.5: U12.2 33.64,6.69
INT2: length 36.5
  Top Layer w0.25: 66.34,6.69 66.34,5.2 65.54,4.4 58.8,4.4 57.6,5.6 57.6,26.4 56.78,27.22 55.37,27.22
  Top Layer w1.5: U79.2 68.64,6.69
INT3: length 60.8
  Top Layer w0.25: 88.84,6.69 88.84,3.78 87.86,2.8 58.1,2.8 56.4,4.5 56.4,25.68 56.15,25.93 55.37,25.93
  Top Layer w1.5: U80.2 91.14,6.69
INT4: length 45.4
  Top Layer w0.25: U11.9 45.72,28.53 45.1,27.9 10.9,27.9 8.84,29.96 8.84,31.69
  Top Layer w1.5: U97.2 11.14,31.69
INT5: length 21.6
  Top Layer w0.25: 31.34,31.69 31.4,31.63 31.4,30.3 31.88,29.82 U11.7
  Top Layer w1.5: U98.2 33.64,31.69
INT6: length 14.8
  Top Layer w0.25: U11.22 65.62,29.82 66.34,30.54 66.34,31.69
  Top Layer w1.5: U99.2 68.64,31.69
INT7: length 38.4
  Top Layer w0.25: U11.20 87.82,28.53 88.84,29.54 88.84,31.69
  Top Layer w1.5: U100.2 91.14,31.69
INT8: length 66.1
  Top Layer w0.25: U72.13 47.68,75.92 47.25,75.5 47.25,55.25 45,53 10.25,53 8.75,54.5 8.75,56.6 8.84,56.69
  Top Layer w1.5: U140.2 11.14,56.69
INT9: length 42.9
  Top Layer w0.25: 31.34,56.69 31.34,54.66 31.75,54.25 44.5,54.25 45.75,55.5 45.75,75.75 47.25,77.25 48.61,77.25 U72.11
  Top Layer w1.5: U139.2 33.64,56.69
INT10: length 32.5
  Top Layer w0.25: 66.34,56.69 60.06,56.69 57.5,59.25 57.5,76.25 56.53,77.22 U72.18
  Top Layer w1.5: U138.2 68.64,56.69
INT11: length 58.5
  Top Layer w0.25: 88.84,56.69 88.84,54.59 88,53.75 60,53.75 56,57.75 56,75.5 55.57,75.92 U72.16
  Top Layer w1.5: U137.2 91.14,56.69
INT12: length 44.6
  Top Layer w0.25: 8.84,81.69 8.75,81.6 8.75,79.5 9.72,78.53 U72.9
  Top Layer w1.5: U133.2 11.14,81.69
INT13: length 20.9
  Top Layer w0.25: 31.34,81.69 31.34,80.41 31.93,79.83 U72.7
  Top Layer w1.5: U134.2 33.64,81.69
INT14: length 15.6
  Top Layer w0.25: 66.34,81.69 66.25,81.6 66.25,80.25 65.82,79.83 U72.22
  Top Layer w1.5: U135.2 68.64,81.69
INT15: length 39.5
  Top Layer w0.25: 88.84,81.69 89,81.53 89,79.25 88.28,78.53 U72.20
  Top Layer w1.5: U136.2 91.14,81.69
INT16: length 69
  Bottom Layer w0.25: U257.13 56.86,25.93 57.2,25.58 57.2,3.4 58.6,2 94.5,2 96.2,3.7 96.2,6.61 96.16,6.66
  Bottom Layer w1.5: U209.2 93.86,6.66
INT17: length 44.8
  Bottom Layer w0.25: 73.66,6.66 73.66,4.06 73,3.4 60.7,3.4 59.2,4.9 59.2,25.8 57.8,27.2 55.89,27.2 U257.11
  Bottom Layer w1.5: U210.2 71.36,6.66
INT18: length 31.9
  Bottom Layer w0.25: U257.18 48.53,27.22 47.7,26.4 47.7,9.5 44.9,6.7 38.7,6.7 38.66,6.66
  Bottom Layer w1.5: U211.2 36.36,6.66
INT19: length 60.4
  Bottom Layer w0.25: 16.16,6.66 16.16,3.24 16.9,2.5 44.5,2.5 48.7,6.7 48.7,25.4 49.22,25.93 U257.16
  Bottom Layer w1.5: U212.2 13.86,6.66
INT20: length 44.8
  Bottom Layer w0.25: 96.16,31.66 96.1,31.6 96.1,29.6 95.03,28.53 U257.9
  Bottom Layer w1.5: U213.2 93.86,31.66
INT21: length 21.2
  Bottom Layer w0.25: 73.66,31.66 73.6,31.6 73.6,30.5 72.93,29.82 U257.7
  Bottom Layer w1.5: U214.2 71.36,31.66
INT22: length 15
  Bottom Layer w0.25: 38.66,31.66 38.66,30.44 39.28,29.82 U257.22
  Bottom Layer w1.5: U215.2 36.36,31.66
INT23: length 38.5
  Bottom Layer w0.25: U257.20 17.28,28.53 16.2,29.6 16.2,31.61 16.16,31.66
  Bottom Layer w1.5: U216.2 13.86,31.66
INT24: length 66.4
  Bottom Layer w0.25: U258.13 56.86,75.92 57.3,75.48 57.3,56 60.3,53 95.2,53 96.2,54 96.2,56.61 96.16,56.66
  Bottom Layer w1.5: U217.2 93.86,56.66
INT25: length 41.9
  Bottom Layer w0.25: 73.66,56.66 73.7,56.61 73.7,55.3 73.1,54.7 61.6,54.7 59.3,57 59.3,75.9 57.97,77.22 U258.11
  Bottom Layer w1.5: U218.2 71.36,56.66
INT26: length 32.4
  Bottom Layer w0.25: U258.18 48.22,77.22 47.3,76.3 47.3,58.7 45.26,56.66 38.66,56.66
  Bottom Layer w1.5: U219.2 36.36,56.66
INT27: length 58.4
  Bottom Layer w0.25: 16.16,56.66 16.2,56.61 16.2,55 17.4,53.8 45.8,53.8 48.7,56.7 48.7,75.6 49.03,75.92 U258.16
  Bottom Layer w1.5: U220.2 13.86,56.66
INT28: length 44.8
  Bottom Layer w0.25: U258.9 95.03,78.53 96.1,79.6 96.1,81.6 96.16,81.66
  Bottom Layer w1.5: U221.2 93.86,81.66
INT29: length 21.4
  Bottom Layer w0.25: U258.7 73.12,79.83 73.7,80.4 73.7,81.61 73.66,81.66
  Bottom Layer w1.5: U222.2 71.36,81.66
INT30: length 14.9
  Bottom Layer w0.25: 38.66,81.66 38.7,81.61 38.7,80.5 39.38,79.83 U258.22
  Bottom Layer w1.5: U223.2 36.36,81.66
INT31: length 38.5
  Bottom Layer w0.25: U258.20 17.28,78.53 16.1,79.7 16.1,81.6 16.16,81.66
  Bottom Layer w1.5: U224.2 13.86,81.66
VADD: length 20.1
  Top Layer w1: v1(61.5,97.5) 59.02,97.5 R300.1 ; v1(61.5,72.5) 61.48,72.52 R296.1 ; R192.1 61.48,22.52 v1(61.5,22.5) ; R228.1 59.02,47.5 v1(61.5,47.5)
  Bottom Layer w1: v1(43.5,47.5) 45.98,47.5 v1(46,47.52) ; v1(43.5,72.5) 45.98,72.5 R552.1 ; R544.1 45.98,22.5 v1(43.5,22.5) ; R556.1 45.98,97.5 v1(43.5,97.5)
  vias: v1(1.5,97.52) v1(1.5,72.5) v1(1.5,47.52) v1(1.5,22.52) v1(23.75,22.52) v1(23.76,97.52) v1(23.78,72.52) v1(23.76,47.52) v1(53.27,90.73) v1(81.24,72.52) v1(81.26,97.52) v1(81.27,47.52) v1(81.27,22.52) v1(103.5,97.52) v1(103.5,72.52) v1(103.5,47.52) v1(103.5,22.52)
VGND:
  vias: v1(11.23,97.5) v1(11.23,91.93) v1(11.23,72.47) v1(11.23,66.93) v1(11.23,47.5) v1(11.23,41.93) v1(11.23,22.5) v1(11.23,16.93) v1(13.77,97.5) v1(13.77,91.96) v1(13.77,72.5) v1(13.77,66.93) v1(13.77,47.47) v1(13.77,22.5) v1(13.77,16.93) v1(13.87,41.96) v1(33.73,97.5) v1(33.73,91.93) v1(33.73,72.47) v1(33.73,66.93) v1(33.73,22.47) v1(33.73,16.93) v1(36.27,97.47) v1(36.27,91.93) v1(36.27,72.5) v1(36.27,66.96) v1(36.27,22.5) v1(36.27,16.96) v1(53.78,14.4) v1(53.78,12.2) v1(68.73,97.47) v1(68.73,91.96) v1(68.73,72.5) v1(68.73,66.93) v1(68.73,22.5) v1(68.73,16.96) v1(68.75,42) v1(71.25,42) v1(71.27,97.5) v1(71.27,91.96) v1(71.27,72.5) v1(71.27,66.93) v1(71.27,22.5) v1(71.27,16.93) v1(91.23,97.47) v1(91.23,91.93) v1(91.23,72.5) v1(91.23,66.93) v1(91.23,47.5) v1(91.23,41.93) v1(91.23,22.47) v1(91.23,16.96) v1(93.77,97.5) v1(93.77,91.93) v1(93.77,72.47) v1(93.77,66.96) v1(93.77,47.5) v1(93.77,41.93) v1(93.77,22.47) v1(93.77,16.93)
VOUT: length 3
  Top Layer w0.5: U10.1 53.93,88.19 55.6,86.52
WEIGHT0: length 60.9
  Top Layer w0.25: 15.46,6.69 15.46,3.94 16.9,2.5 43.7,2.5 46.2,5 46.2,24.9 47.88,26.57 U11.12
  Top Layer w1.5: U2.2 13.66,6.69
WEIGHT1: length 33.1
  Top Layer w0.25: U11.10 46.48,27.88 44.5,25.89 44.5,7.3 43.9,6.7 37.97,6.7 37.96,6.69
  Top Layer w1.5: U13.2 36.16,6.69
WEIGHT2: length 44.1
  Top Layer w0.25: 55.37,26.57 56.43,26.57 57,26 57,5 58.5,3.5 71.9,3.5 72.96,4.56 72.96,6.69
  Top Layer w1.5: U81.2 71.16,6.69
WEIGHT3: length 67.9
  Top Layer w0.25: 95.46,6.69 95.46,3.46 94,2 57.7,2 55.4,4.3 55.4,25.24 55.37,25.28
  Top Layer w1.5: U82.2 93.66,6.69
WEIGHT4: length 38.4
  Top Layer w0.25: U11.8 44.97,29.18 44.6,28.8 16.5,28.8 15.46,29.84 15.46,31.69
  Top Layer w1.5: U101.2 13.66,31.69
WEIGHT5: length 16.7
  Top Layer w0.25: U11.6 36.22,30.47 35.8,30.9 35.8,31.8
  Top Layer w1.5: U102.2 36.16,31.69
WEIGHT6: length 21.9
  Top Layer w0.25: U11.21 71.97,29.18 72.96,30.16 72.96,31.69
  Top Layer w1.5: U103.2 71.16,31.69
WEIGHT7: length 45.6
  Top Layer w0.25: U11.19 94.38,27.88 95.46,28.96 95.46,31.69
  Top Layer w1.5: U104.2 93.66,31.69
WEIGHT8: length 58
  Top Layer w0.25: 15.46,56.69 18.65,53.5 44.5,53.5 46.5,55.5 46.5,75.75 47.32,76.58 U72.12
  Top Layer w1.5: 13.66,56.69 U148.2
